# EAGLE schematic Stovetop-v3.0_Release (EAGLE 9.5.2)

## Sheet 1 of 10
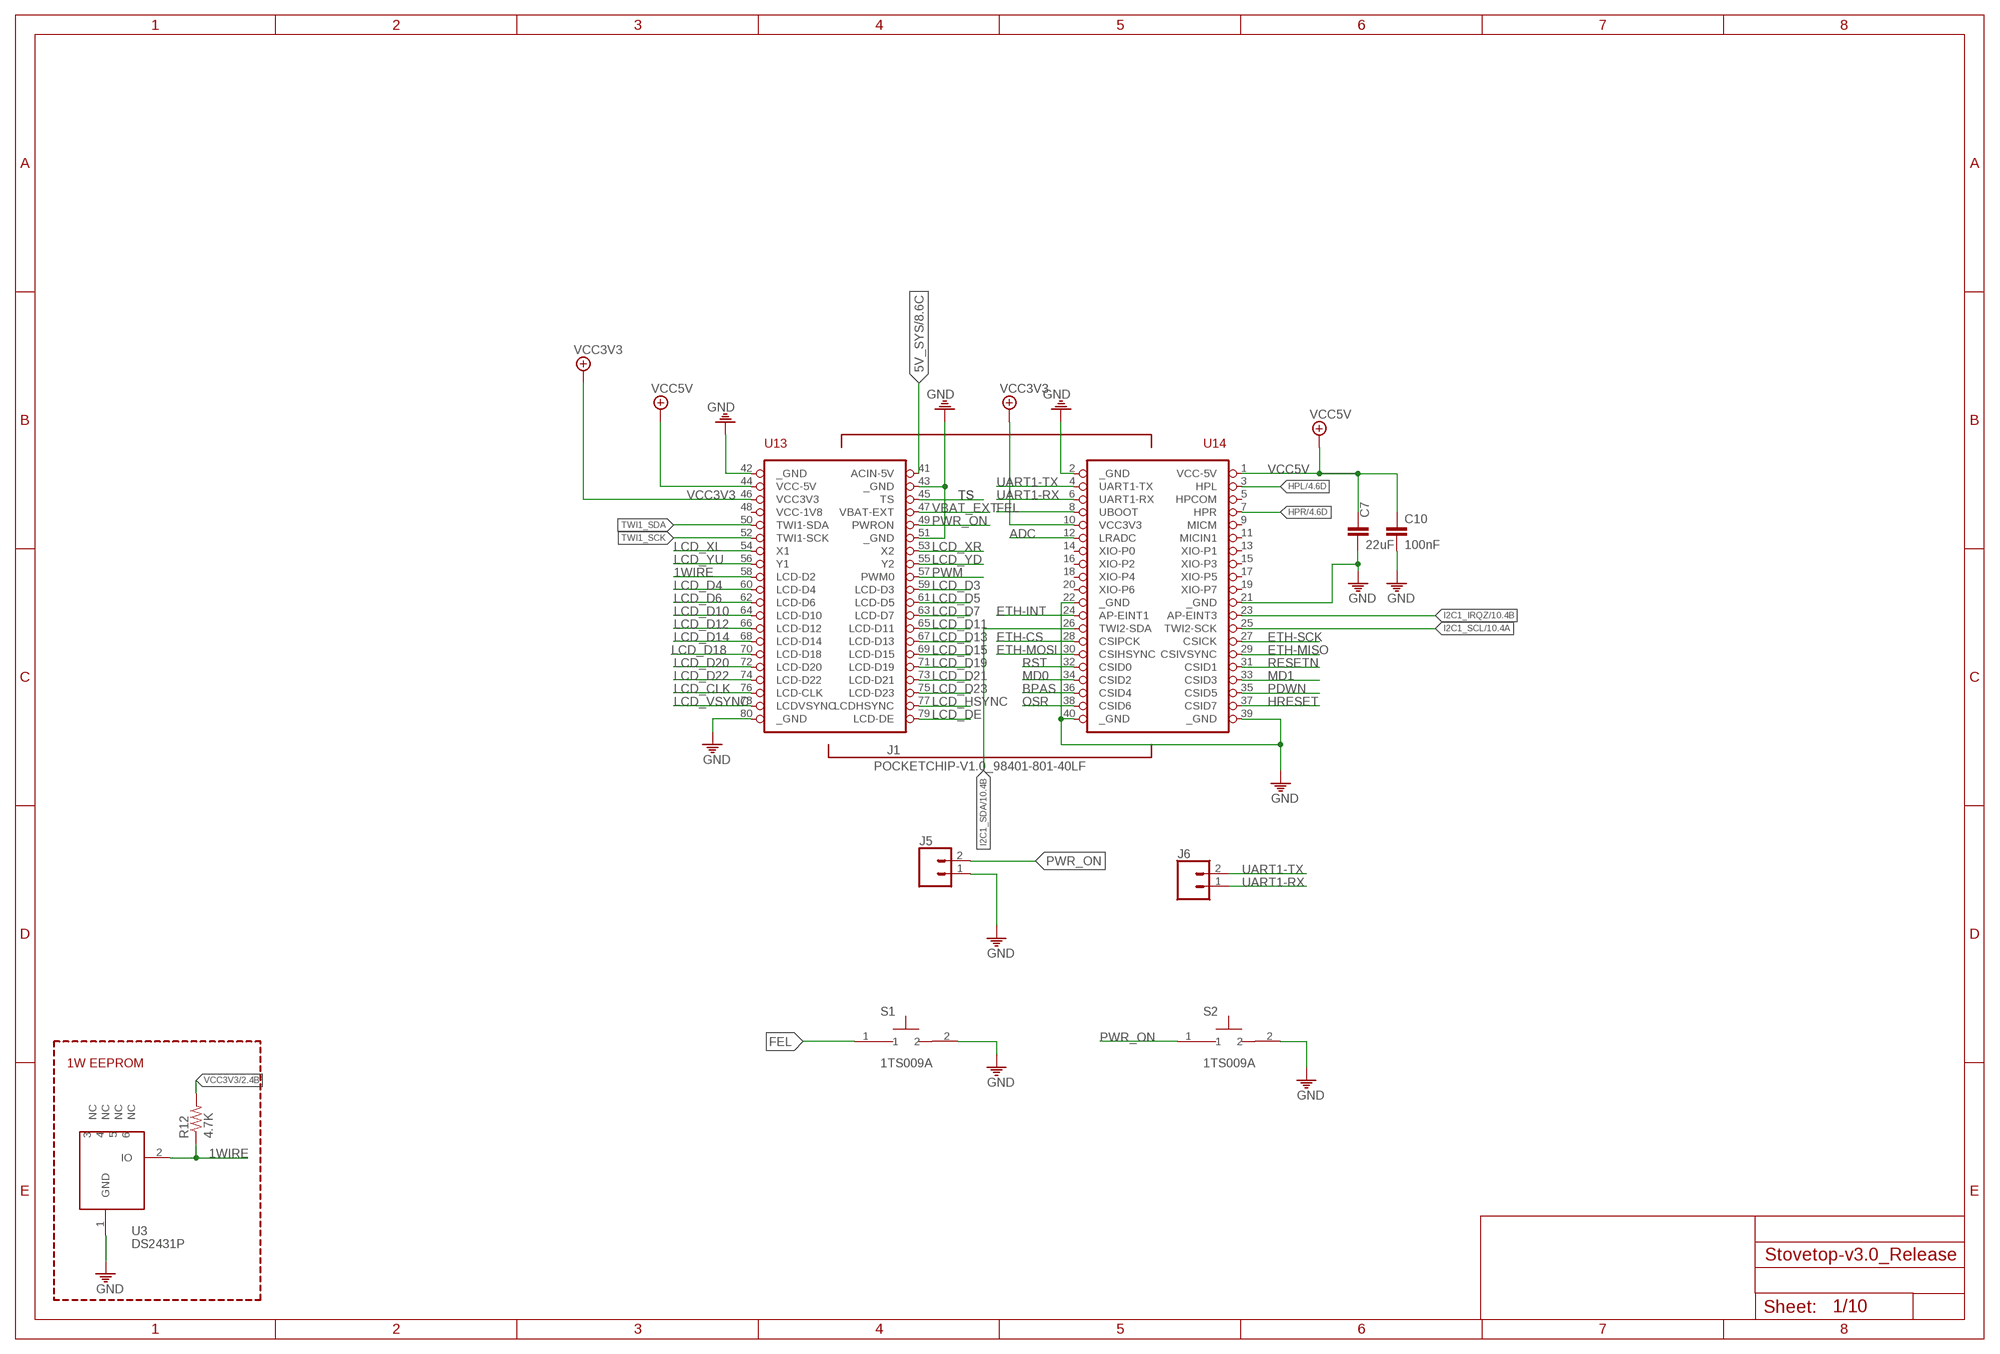
[diagram p0: schematic, sheet 1]

### Parts
C7  22uF  C1206_22UF_50V_10%  [C1206]
C10  100nF  C0402_100NF_50V_10%  [C0402]
J1  POCKETCHIP-V1.0_98401-801-40LF  [POCKETCHIP-V1.0_98401-801-40LF]
J5  CONN_02LOCK  [1X02_LOCK]
J6  CONN_02LOCK  [1X02_LOCK]
R12  4.7K  R0402_4K7_5%  [R0402]
S1  1TS009A  [1TS009A]
S2  1TS009A  [1TS009A]
U3  DS2431P  [TSOC6]

### Nets
1WIRE: J1.58(LCD-D2) R12.1 U3.2(IO)
5V_SYS: J1.41(ACIN-5V) ; also sheet 8,9
ADC: J1.12(LRADC)
BPAS: J1.36(CSID4) ; also sheet 4
ETH-CS: J1.28(CSIPCK) ; also sheet 2
ETH-INT: J1.24(AP-EINT1) ; also sheet 2
ETH-MISO: J1.29(CSIVSYNC) ; also sheet 2
ETH-MOSI: J1.30(CSIHSYNC) ; also sheet 2
ETH-SCK: J1.27(CSICK) ; also sheet 2
FEL: J1.8(UBOOT) S1.1
GND: C7.2 C10.2 J1.2(_GND) J1.21(_GND) J1.22(_GND) J1.39(_GND) J1.40(_GND) J1.42(_GND) J1.43(_GND) J1.51(_GND) J1.80(_GND) J5.1 S1.2 S2.2 U3.1(GND) ; also sheet 2,3,4,5,6,7,8,9,10
HPL: J1.3(HPL) ; also sheet 4
HPR: J1.7(HPR) ; also sheet 4
HRESET: J1.37(CSID7) ; also sheet 10
I2C1_IRQZ: J1.23(AP-EINT3) ; also sheet 10
I2C1_SCL: J1.25(TWI2-SCK) ; also sheet 10
I2C1_SDA: J1.26(TWI2-SDA) ; also sheet 10
LCD_CLK: J1.76(LCD-CLK) ; also sheet 5
LCD_D3: J1.59(LCD-D3) ; also sheet 5
LCD_D4: J1.60(LCD-D4) ; also sheet 5
LCD_D5: J1.61(LCD-D5) ; also sheet 5
LCD_D6: J1.62(LCD-D6) ; also sheet 5
LCD_D7: J1.63(LCD-D7) ; also sheet 5
LCD_D10: J1.64(LCD-D10) ; also sheet 5
LCD_D11: J1.65(LCD-D11) ; also sheet 5
LCD_D12: J1.66(LCD-D12) ; also sheet 5
LCD_D13: J1.67(LCD-D13) ; also sheet 5
LCD_D14: J1.68(LCD-D14) ; also sheet 5
LCD_D15: J1.69(LCD-D15) ; also sheet 5
LCD_D18: J1.70(LCD-D18) ; also sheet 5
LCD_D19: J1.71(LCD-D19) ; also sheet 5
LCD_D20: J1.72(LCD-D20) ; also sheet 5
LCD_D21: J1.73(LCD-D21) ; also sheet 5
LCD_D22: J1.74(LCD-D22) ; also sheet 5
LCD_D23: J1.75(LCD-D23) ; also sheet 5
LCD_DE: J1.79(LCD-DE) ; also sheet 5
LCD_HSYNC: J1.77(LCDHSYNC) ; also sheet 5
LCD_VSYNC: J1.78(LCDVSYNC) ; also sheet 5
LCD_XL: J1.54(X1)
LCD_XR: J1.53(X2)
LCD_YD: J1.55(Y2)
LCD_YU: J1.56(Y1)
MD0: J1.34(CSID2) ; also sheet 4
MD1: J1.33(CSID3) ; also sheet 4
OSR: J1.38(CSID6) ; also sheet 4
PDWN: J1.35(CSID5) ; also sheet 4
PWM: J1.57(PWM0)
PWR_ON: J1.49(PWRON) J5.2 S2.1
RESETN: J1.31(CSID1)
RST: J1.32(CSID0) ; also sheet 5
TS: J1.45(TS)
TWI1_SCK: J1.52(TWI1-SCK) ; also sheet 5,6
TWI1_SDA: J1.50(TWI1-SDA) ; also sheet 5,6
UART1-RX: J1.6(UART1-RX) J6.1 ; also sheet 9
UART1-TX: J1.4(UART1-TX) J6.2 ; also sheet 9
VBAT_EXT: J1.47(VBAT-EXT)
VCC3V3: J1.10(VCC3V3) J1.46(VCC3V3) R12.2 ; also sheet 2,3,4,5,9,10
VCC5V: C7.1 C10.1 J1.1(VCC-5V) J1.44(VCC-5V) ; also sheet 3,4,10
Unconnected: J1.5(HPCOM) J1.9(MICM) J1.11(MICIN1) J1.13(XIO-P1) J1.14(XIO-P0) J1.15(XIO-P3) J1.16(XIO-P2) J1.17(XIO-P5) J1.18(XIO-P4) J1.19(XIO-P7) J1.20(XIO-P6) J1.48(VCC-1V8) U3.3(NC) U3.4(NC) U3.5(NC) U3.6(NC)

### Notes on the sheet
- 1W EEPROM

## Sheet 2 of 10
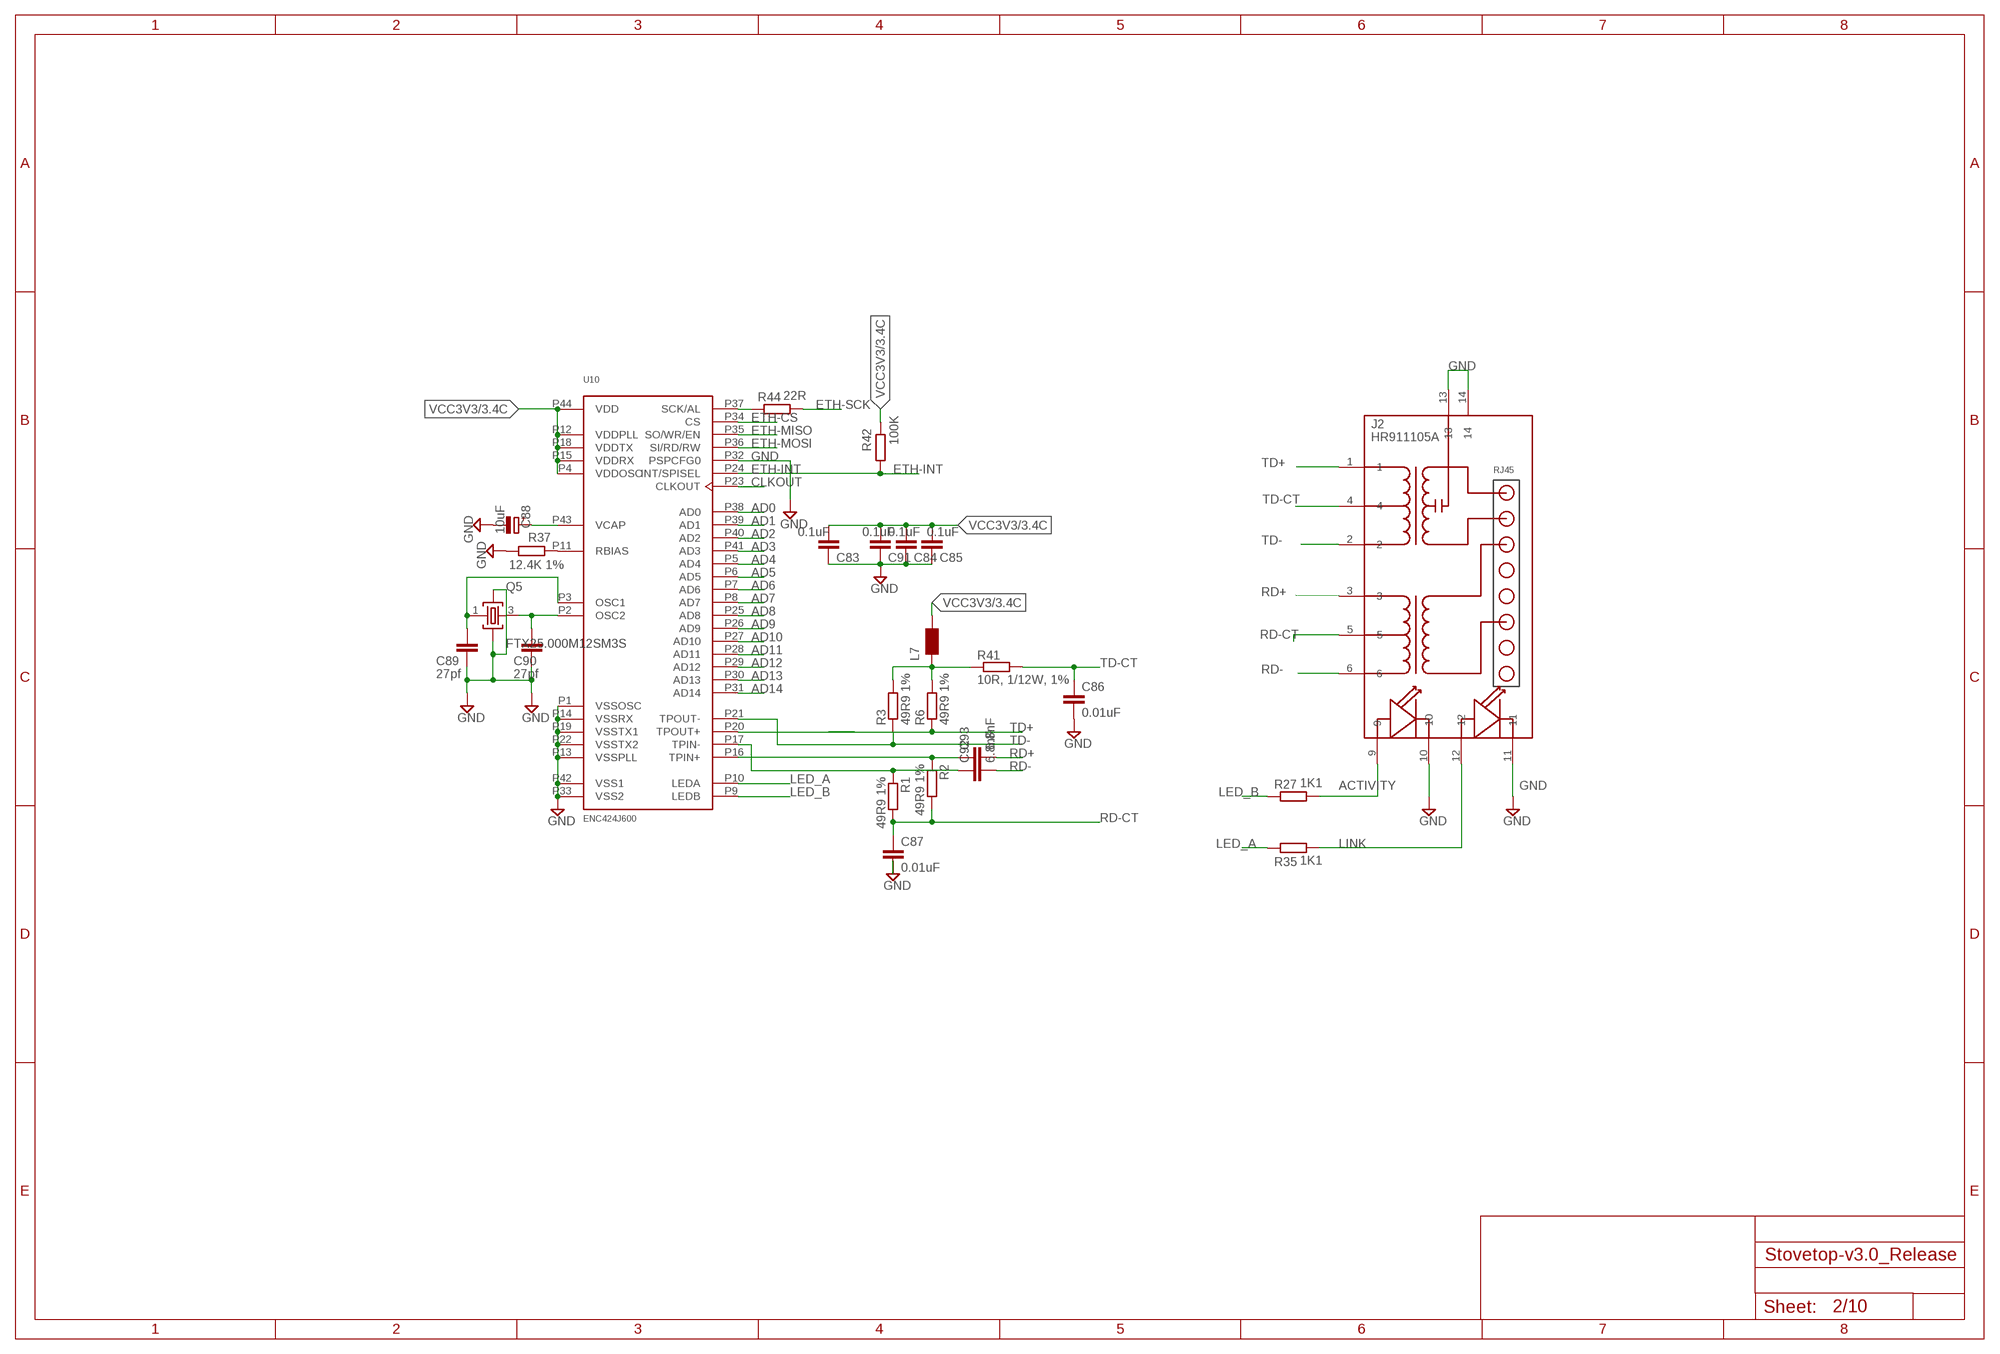
[diagram p1: schematic, sheet 2]

### Parts
C83  0.1uF  C-EUC0603  [C0603]
C84  0.1uF  C-EUC0603  [C0603]
C85  0.1uF  C-EUC0603  [C0603]
C86  0.01uF  C-EUC0603  [C0603]
C87  0.01uF  C-EUC0603  [C0603]
C88  10uF  CPOL-EUSMCA  [SMC_A]
C89  27pf  C-EUC0603  [C0603]
C90  27pf  C-EUC0603  [C0603]
C91  0.1uF  C-EUC0603  [C0603]
C92  6.8nF  C-EUC0603  [C0603]
C93  6.8nF  C-EUC0603  [C0603]
J2  HR911105A  [HR911105A]
L7  WE-KIL_0805  [WE-KI_0805_B]
Q5  FTX25.000M12SM3S  CRISTALLI_0846_FTX25.000M12SM3S  [CRISTALLI_CRYSTAL3.2X2.5]
R1  49R9 1%  R-EU_R0603  [R0603]
R2  49R9 1%  R-EU_R0603  [R0603]
R3  49R9 1%  R-EU_R0603  [R0603]
R6  49R9 1%  R-EU_R0603  [R0603]
R27  1K1  R-EU_R0603  [R0603]
R35  1K1  R-EU_R0603  [R0603]
R37  12.4K 1%  R-EU_R0603  [R0603]
R41  10R, 1/12W, 1%  R-EU_R0603  [R0603]
R42  100K  R-EU_R0603  [R0603]
R44  22R  R-EU_R0603  [R0603]
U10  ENC424J600  [TQFP44]

### Nets
ACTIVITY: J2.9 R27.2
AD0: U10.P38(AD0)
AD1: U10.P39(AD1)
AD2: U10.P40(AD2)
AD3: U10.P41(AD3)
AD4: U10.P5(AD4)
AD5: U10.P6(AD5)
AD6: U10.P7(AD6)
AD7: U10.P8(AD7)
AD8: U10.P25(AD8)
AD9: U10.P26(AD9)
AD10: U10.P27(AD10)
AD11: U10.P28(AD11)
AD12: U10.P29(AD12)
AD13: U10.P30(AD13)
AD14: U10.P31(AD14)
CCT: L7.2 R3.2 R6.2 R41.1
CLKOUT: U10.P23(CLKOUT)
DSFGDF [SPI DIFF]: C92.1 R1.1 U10.P17(TPIN-)
DSGDFSG [SPI DIFF]: C93.1 R2.1 U10.P16(TPIN+)
ETH-CS: U10.P34(CS) ; also sheet 1
ETH-INT: R42.2 U10.P24(INT/SPISEL) ; also sheet 1
ETH-MISO: U10.P35(SO/WR/EN) ; also sheet 1
ETH-MOSI: U10.P36(SI/RD/RW) ; also sheet 1
ETH-SCK: R44.2 ; also sheet 1
GND: C83.2 C84.2 C85.2 C86.2 C87.2 C88.- C89.2 C90.2 C91.2 J2.10 J2.11 J2.13 J2.14 Q5.2 Q5.4 R37.2 U10.P1(VSSOSC) U10.P13(VSSPLL) U10.P14(VSSRX) U10.P19(VSSTX1) U10.P22(VSSTX2) U10.P32(PSPCFG0) U10.P33(VSS2) U10.P42(VSS1) ; also sheet 1,3,4,5,6,7,8,9,10
LED_A: R35.1 U10.P10(LEDA)
LED_B: R27.1 U10.P9(LEDB)
LINK: J2.12 R35.2
N$42: R44.1 U10.P37(SCK/AL)
N$50: C88.+ U10.P43(VCAP)
N$51: R37.1 U10.P11(RBIAS)
N$73: C89.1 Q5.1 U10.P3(OSC1)
N$74: C90.1 Q5.3 U10.P2(OSC2)
RD+ [SPI DIFF]: C93.2 J2.3
RD- [SPI DIFF]: C92.2 J2.6
RD-CT: C87.1 J2.5 R1.2 R2.2
TD+ [SPI DIFF]: J2.1 R6.1 U10.P20(TPOUT+)
TD- [SPI DIFF]: J2.2 R3.1 U10.P21(TPOUT-)
TD-CT: C86.1 J2.4 R41.2
VCC3V3: C83.1 C84.1 C85.1 C91.1 L7.1 R42.1 U10.P4(VDDOSC) U10.P12(VDDPLL) U10.P15(VDDRX) U10.P18(VDDTX) U10.P44(VDD) ; also sheet 1,3,4,5,9,10

## Sheet 3 of 10
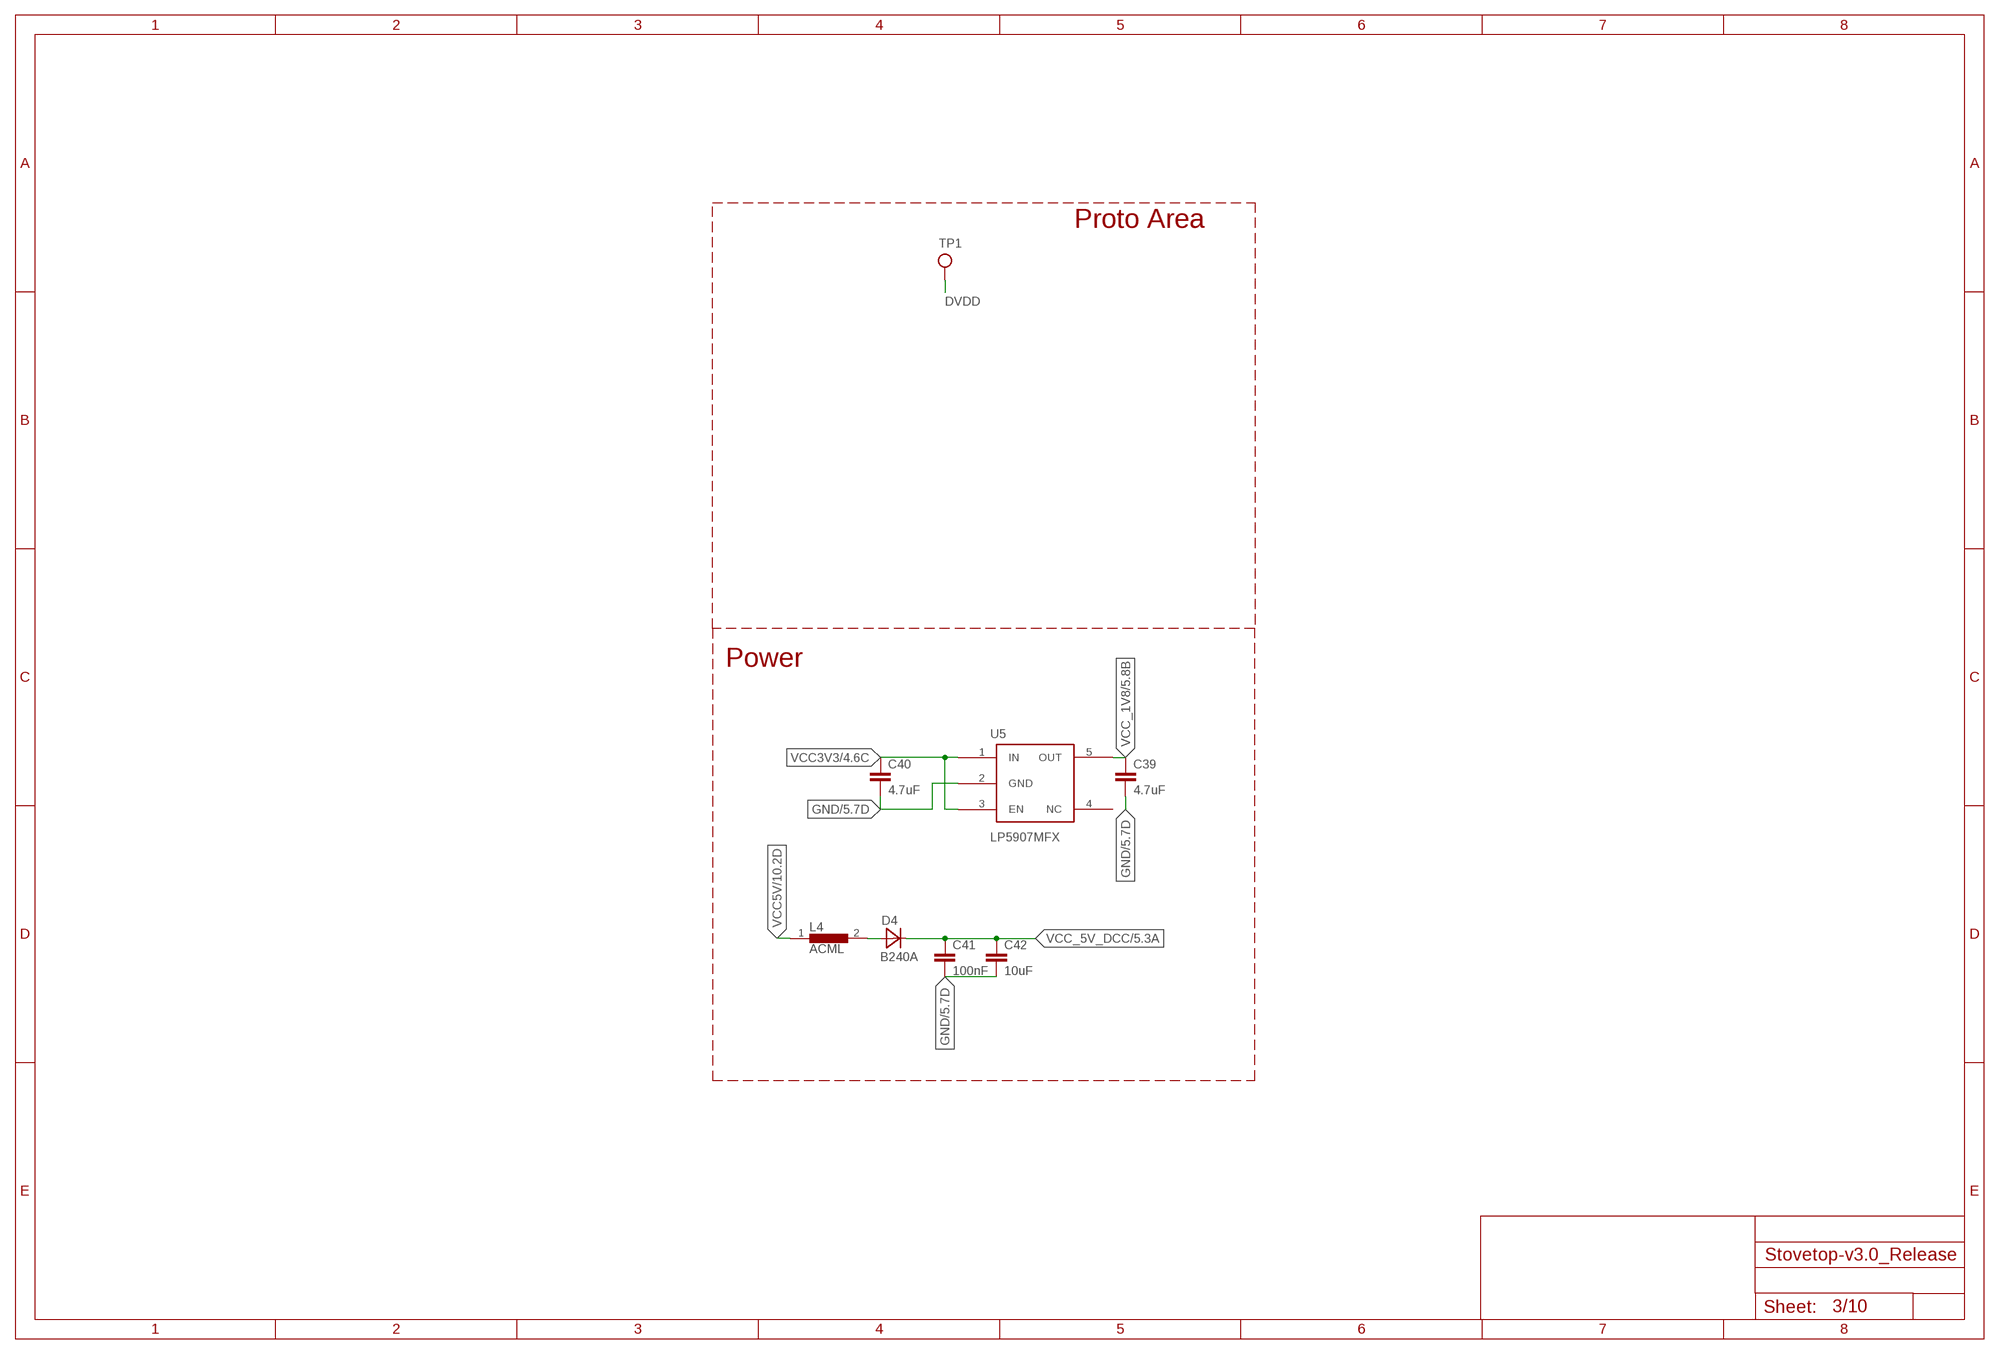
[diagram p2: schematic, sheet 3]

### Parts
C39  4.7uF  CAPACITOR  [1608_0603]
C40  4.7uF  CAPACITOR  [1608_0603]
C41  100nF  CAPACITOR  [1608_0603]
C42  10uF  CAPACITOR  [1608_0603]
D4  B240A  [SMA]
L4  ACML  [0603]
TP1  CHIP_HDMI_TEST_POINT  [CHIP_HDMI_TP-1MMX1MM]
U5  LP5907MFX  [SOT23-5]

### Nets
DVDD: TP1.0 ; also sheet 5
GND: C39.2 C40.2 C41.2 C42.2 U5.2(GND) ; also sheet 1,2,4,5,6,7,8,9,10
N$1: D4.1(A) L4.2
VCC3V3: C40.1 U5.1(IN) U5.3(EN) ; also sheet 1,2,4,5,9,10
VCC5V: L4.1 ; also sheet 1,4,10
VCC_1V8: C39.1 U5.5(OUT) ; also sheet 5
VCC_5V_DCC: C41.1 C42.1 D4.2(C) ; also sheet 5,6
Unconnected: U5.4(NC)

### Notes on the sheet
- Proto Area
- Power

## Sheet 4 of 10
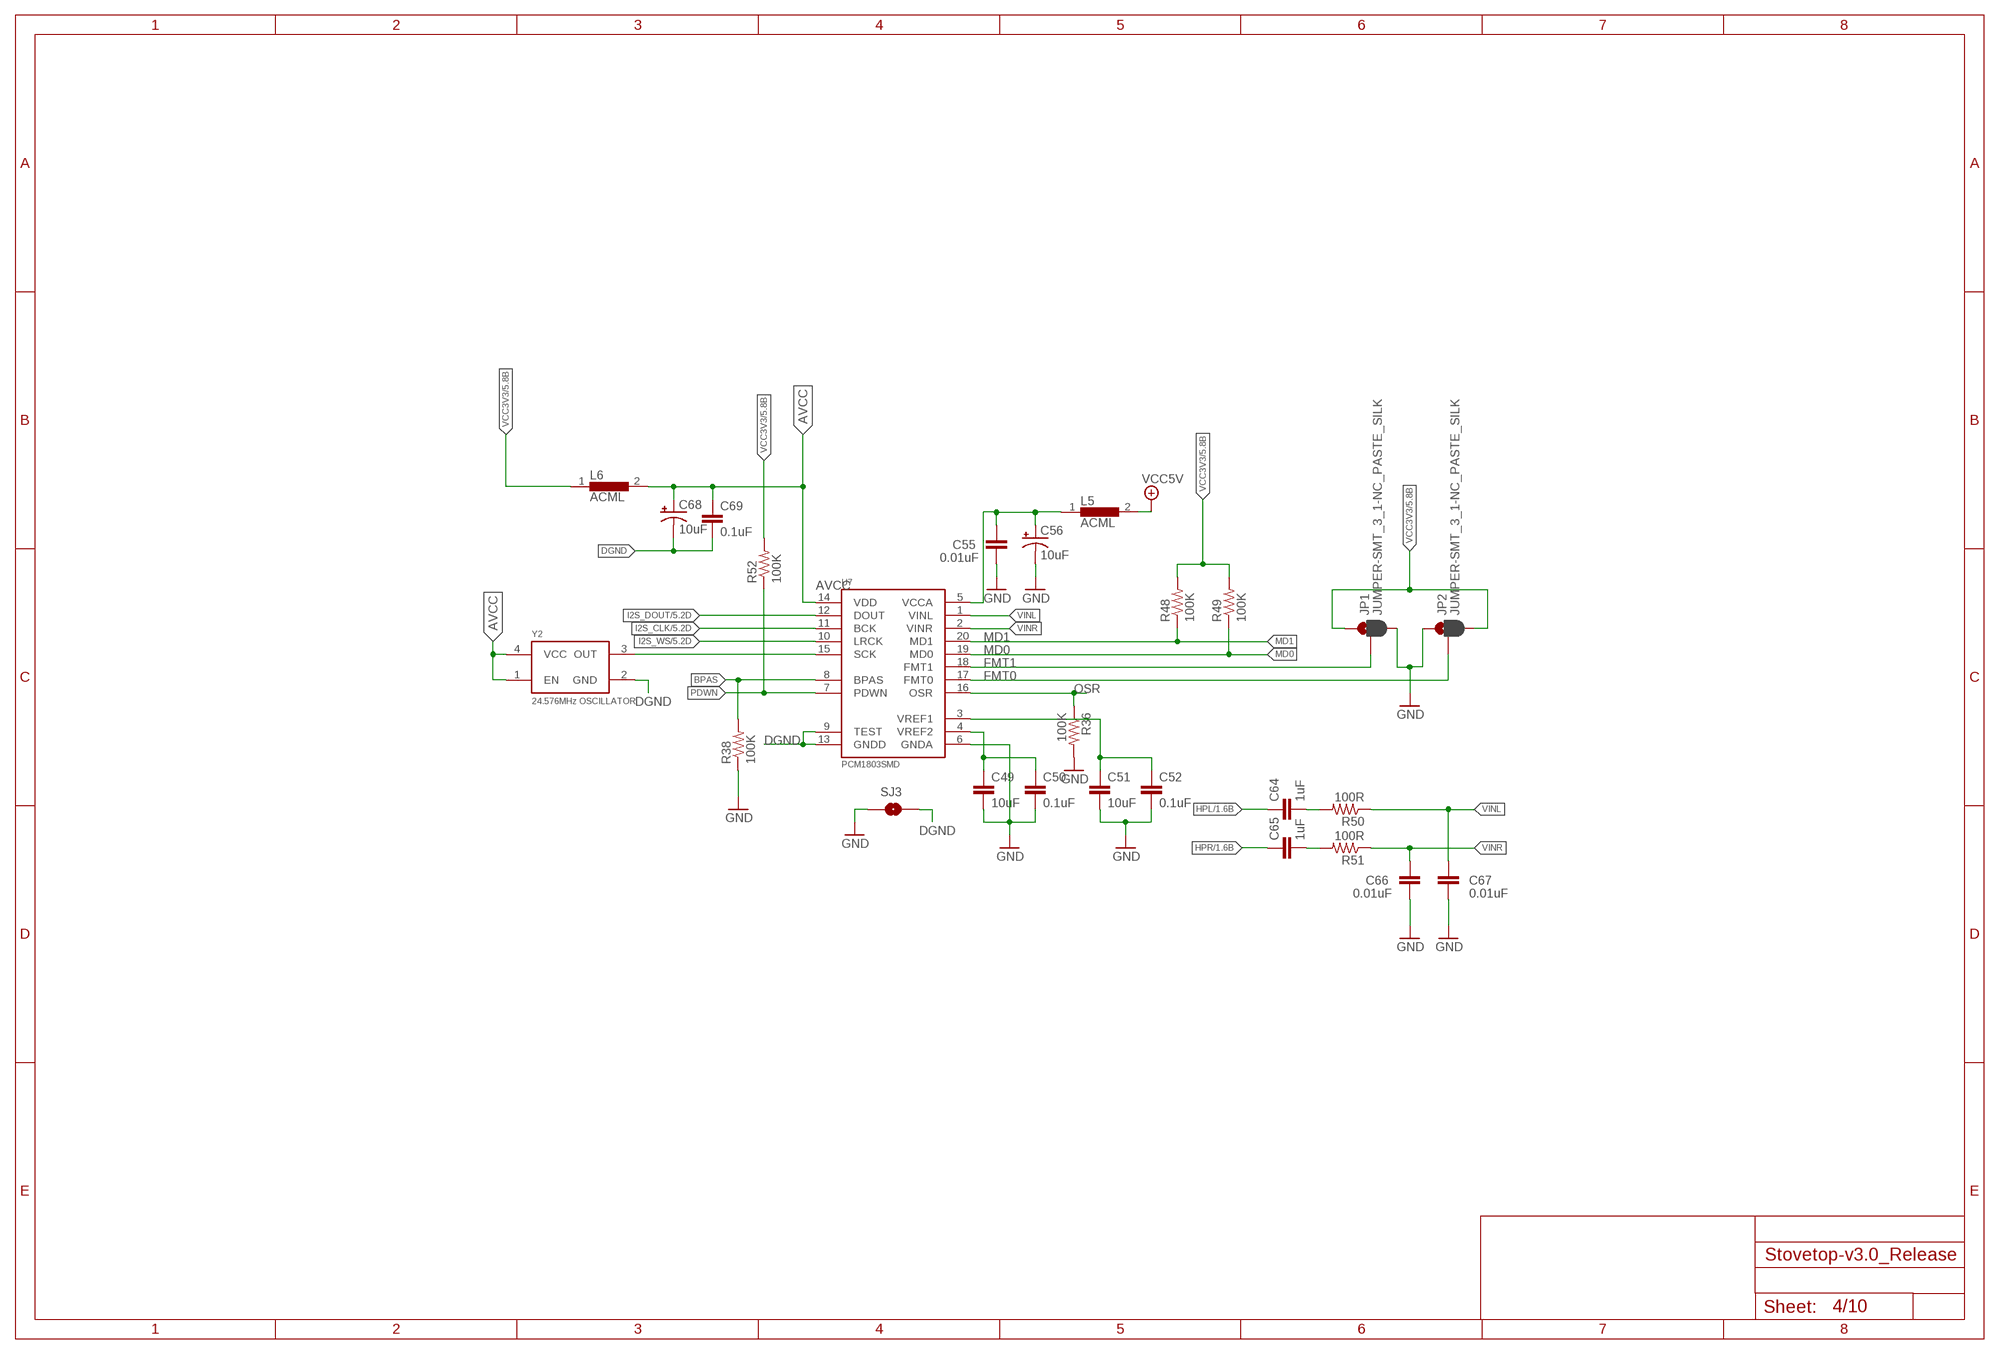
[diagram p3: schematic, sheet 4]

### Parts
C49  10uF  4.7UF-0603-6.3V-(10%)  [0603]
C50  0.1uF  CAP0402-CAP  [0402-CAP]
C51  10uF  4.7UF-0603-6.3V-(10%)  [0603]
C52  0.1uF  CAP0402-CAP  [0402-CAP]
C55  0.01uF  CAP0402-CAP  [0402-CAP]
C56  10uF  CAP_POL1206  [EIA3216]
C64  1uF  CAP0402-CAP  [0402-CAP]
C65  1uF  CAP0402-CAP  [0402-CAP]
C66  0.01uF  CAP0402-CAP  [0402-CAP]
C67  0.01uF  CAP0402-CAP  [0402-CAP]
C68  10uF  CAP_POL1206  [EIA3216]
C69  0.1uF  CAP0402-CAP  [0402-CAP]
JP1  JUMPER-SMT_3_1-NC_PASTE_SILK  [SMT-JUMPER_3_1-NC_PASTE_SILK]
JP2  JUMPER-SMT_3_1-NC_PASTE_SILK  [SMT-JUMPER_3_1-NC_PASTE_SILK]
L5  ACML  [0603]
L6  ACML  [0603]
R36  100K  RESISTOR  [J1-0603]
R38  100K  RESISTOR  [J1-0603]
R48  100K  RESISTOR  [J1-0603]
R49  100K  RESISTOR  [J1-0603]
R50  100R  RESISTOR  [J1-0603]
R51  100R  RESISTOR  [J1-0603]
R52  100K  RESISTOR  [J1-0603]
SJ3  SPARKFUN_SOLDERJUMPERTRACE  [SPARKFUN_SJ_2S-TRACE]
U7  PCM1803SMD  [SSOP20]
Y2  24.576MHz OSCILLATOR  OSCILLATORSMD6  [CRYSTAL-SMD-7.5X5.2-6PIN]

### Nets
AVCC: C68.A(+) C69.1 L6.2 U7.14(VDD) Y2.1(EN) Y2.4(VCC)
BPAS: R38.2 U7.8(BPAS) ; also sheet 1
DGND: C68.C(-) C69.2 SJ3.2 U7.9(TEST) U7.13(GNDD) Y2.2(GND)
FMT0: JP2.2 U7.17(FMT0)
FMT1: JP1.2 U7.18(FMT1)
GND: C49.2 C50.2 C51.2 C52.2 C55.1 C56.C(-) C66.1 C67.1 JP1.3 JP2.1 R36.2 R38.1 SJ3.1 U7.6(GNDA) ; also sheet 1,2,3,5,6,7,8,9,10
HPL: C64.1 ; also sheet 1
HPR: C65.1 ; also sheet 1
I2S_CLK: U7.11(BCK) ; also sheet 5
I2S_DOUT: U7.12(DOUT) ; also sheet 5
I2S_WS: U7.10(LRCK) ; also sheet 5
MD0: R49.1 U7.19(MD0) ; also sheet 1
MD1: R48.1 U7.20(MD1) ; also sheet 1
N$37: C49.1 C50.1 U7.4(VREF2)
N$38: C51.1 C52.1 U7.3(VREF1)
N$39: U7.15(SCK) Y2.3(OUT)
N$56: C55.2 C56.A(+) L5.1 U7.5(VCCA)
N$71: C64.2 R50.2
N$72: C65.2 R51.2
OSR: R36.1 U7.16(OSR) ; also sheet 1
PDWN: R52.1 U7.7(PDWN) ; also sheet 1
VCC3V3: JP1.1 JP2.3 L6.1 R48.2 R49.2 R52.2 ; also sheet 1,2,3,5,9,10
VCC5V: L5.2 ; also sheet 1,3,10
VINL: C67.2 R50.1 U7.1(VINL)
VINR: C66.2 R51.1 U7.2(VINR)

## Sheet 5 of 10
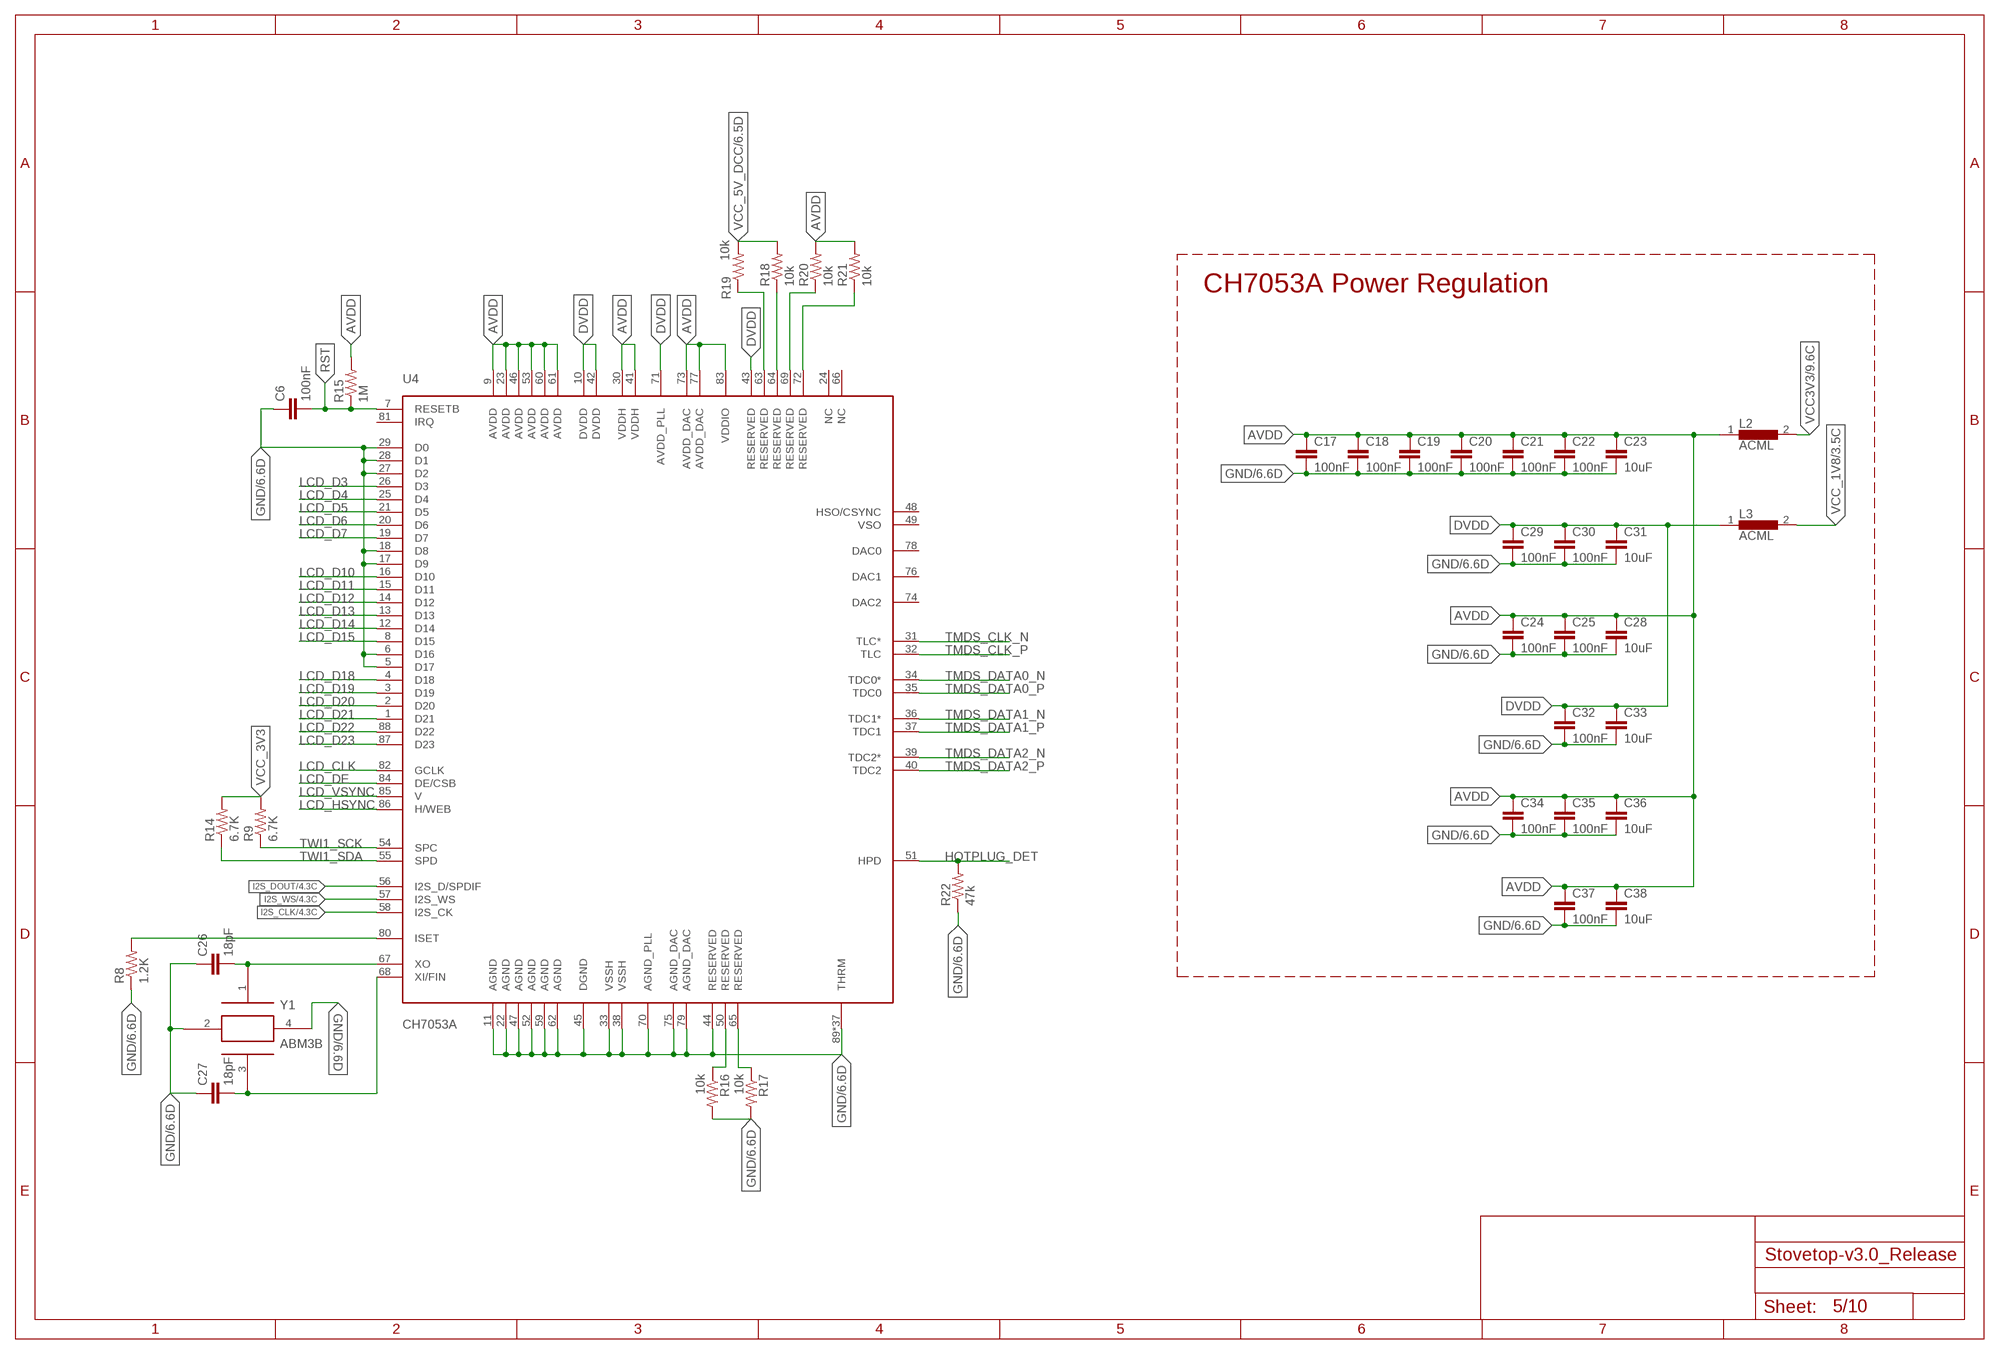
[diagram p4: schematic, sheet 5]

### Parts
C6  100nF  CAPACITOR  [1608_0603]
C17  100nF  CAPACITOR  [1608_0603]
C18  100nF  CAPACITOR  [1608_0603]
C19  100nF  CAPACITOR  [1608_0603]
C20  100nF  CAPACITOR  [1608_0603]
C21  100nF  CAPACITOR  [1608_0603]
C22  100nF  CAPACITOR  [1608_0603]
C23  10uF  CAPACITOR  [1608_0603]
C24  100nF  CAPACITOR  [1608_0603]
C25  100nF  CAPACITOR  [1608_0603]
C26  18pF  CAPACITOR  [1608_0603]
C27  18pF  CAPACITOR  [1608_0603]
C28  10uF  CAPACITOR  [1608_0603]
C29  100nF  CAPACITOR  [1608_0603]
C30  100nF  CAPACITOR  [1608_0603]
C31  10uF  CAPACITOR  [1608_0603]
C32  100nF  CAPACITOR  [1608_0603]
C33  10uF  CAPACITOR  [1608_0603]
C34  100nF  CAPACITOR  [1608_0603]
C35  100nF  CAPACITOR  [1608_0603]
C36  10uF  CAPACITOR  [1608_0603]
C37  100nF  CAPACITOR  [1608_0603]
C38  10uF  CAPACITOR  [1608_0603]
L2  ACML  [0603]
L3  ACML  [0603]
R8  1.2K  RESISTOR  [J1-0603]
R9  6.7K  RESISTOR  [J1-0603]
R14  6.7K  RESISTOR  [J1-0603]
R15  1M  RESISTOR  [J1-0603]
R16  10k  RESISTOR  [J1-0603]
R17  10k  RESISTOR  [J1-0603]
R18  10k  RESISTOR  [J1-0603]
R19  10k  RESISTOR  [J1-0603]
R20  10k  RESISTOR  [J1-0603]
R21  10k  RESISTOR  [J1-0603]
R22  47k  RESISTOR  [J1-0603]
U4  CH7053A  [QFN40P1000X1000X90_HS-89M]
Y1  ABM3B  [ABM3B]

### Nets
AVDD: C17.1 C18.1 C19.1 C20.1 C21.1 C22.1 C23.1 C24.1 C25.1 C28.1 C34.1 C35.1 C36.1 C37.1 C38.1 L2.1 R15.2 R20.2 R21.2 U4.9(AVDD) U4.23(AVDD) U4.30(VDDH) U4.41(VDDH) U4.46(AVDD) U4.53(AVDD) U4.60(AVDD) U4.61(AVDD) U4.73(AVDD_DAC) U4.77(AVDD_DAC) U4.83(VDDIO)
DVDD: C29.1 C30.1 C31.1 C32.1 C33.1 L3.1 U4.10(DVDD) U4.42(DVDD) U4.43(RESERVED) U4.71(AVDD_PLL) ; also sheet 3
GND: C6.1 C17.2 C18.2 C19.2 C20.2 C21.2 C22.2 C23.2 C24.2 C25.2 C26.1 C27.1 C28.2 C29.2 C30.2 C31.2 C32.2 C33.2 C34.2 C35.2 C36.2 C37.2 C38.2 R8.1 R16.2 R17.2 R22.1 U4.5(D17) U4.6(D16) U4.11(AGND) U4.17(D9) U4.18(D8) U4.22(AGND) U4.27(D2) U4.28(D1) U4.29(D0) U4.33(VSSH) U4.38(VSSH) U4.44(RESERVED) U4.45(DGND) U4.47(AGND) U4.52(AGND) U4.59(AGND) U4.62(AGND) U4.70(AGND_PLL) U4.75(AGND_DAC) U4.79(AGND_DAC) U4.89(THRM) U4.P$1(THRM) U4.P$2(THRM) U4.P$3(THRM) U4.P$4(THRM) U4.P$5(THRM) U4.P$6(THRM) U4.P$7(THRM) U4.P$8(THRM) U4.P$9(THRM) U4.P$10(THRM) U4.P$11(THRM) U4.P$12(THRM) U4.P$13(THRM) U4.P$14(THRM) U4.P$15(THRM) U4.P$16(THRM) U4.P$17(THRM) U4.P$18(THRM) U4.P$19(THRM) U4.P$20(THRM) U4.P$21(THRM) U4.P$22(THRM) U4.P$23(THRM) U4.P$24(THRM) U4.P$25(THRM) U4.P$26(THRM) U4.P$27(THRM) U4.P$28(THRM) U4.P$29(THRM) U4.P$30(THRM) U4.P$31(THRM) U4.P$32(THRM) U4.P$33(THRM) U4.P$34(THRM) U4.P$35(THRM) U4.P$36(THRM) Y1.2 Y1.4 ; also sheet 1,2,3,4,6,7,8,9,10
HOTPLUG_DET: R22.2 U4.51(HPD) ; also sheet 6
I2S_CLK: U4.58(I2S_CK) ; also sheet 4
I2S_DOUT: U4.56(I2S_D/SPDIF) ; also sheet 4
I2S_WS: U4.57(I2S_WS) ; also sheet 4
LCD_CLK: U4.82(GCLK) ; also sheet 1
LCD_D3: U4.26(D3) ; also sheet 1
LCD_D4: U4.25(D4) ; also sheet 1
LCD_D5: U4.21(D5) ; also sheet 1
LCD_D6: U4.20(D6) ; also sheet 1
LCD_D7: U4.19(D7) ; also sheet 1
LCD_D10: U4.16(D10) ; also sheet 1
LCD_D11: U4.15(D11) ; also sheet 1
LCD_D12: U4.14(D12) ; also sheet 1
LCD_D13: U4.13(D13) ; also sheet 1
LCD_D14: U4.12(D14) ; also sheet 1
LCD_D15: U4.8(D15) ; also sheet 1
LCD_D18: U4.4(D18) ; also sheet 1
LCD_D19: U4.3(D19) ; also sheet 1
LCD_D20: U4.2(D20) ; also sheet 1
LCD_D21: U4.1(D21) ; also sheet 1
LCD_D22: U4.88(D22) ; also sheet 1
LCD_D23: U4.87(D23) ; also sheet 1
LCD_DE: U4.84(DE/CSB) ; also sheet 1
LCD_HSYNC: U4.86(H/WEB) ; also sheet 1
LCD_VSYNC: U4.85(V) ; also sheet 1
N$9: C27.2 U4.68(XI/FIN) Y1.3
N$24: R8.2 U4.80(ISET)
N$25: R16.1 U4.50(RESERVED)
N$26: R17.1 U4.65(RESERVED)
N$27: R19.1 U4.63(RESERVED)
N$28: R18.1 U4.64(RESERVED)
N$30: R21.1 U4.72(RESERVED)
N$31: R20.1 U4.69(RESERVED)
N$32: C26.2 U4.67(XO) Y1.1
RST: C6.2 R15.1 U4.7(RESETB) ; also sheet 1
TMDS_CLK_N: U4.31(TLC*) ; also sheet 6
TMDS_CLK_P: U4.32(TLC) ; also sheet 6
TMDS_DATA0_N: U4.34(TDC0*) ; also sheet 6
TMDS_DATA0_P: U4.35(TDC0) ; also sheet 6
TMDS_DATA1_N: U4.36(TDC1*) ; also sheet 6
TMDS_DATA1_P: U4.37(TDC1) ; also sheet 6
TMDS_DATA2_N: U4.39(TDC2*) ; also sheet 6
TMDS_DATA2_P: U4.40(TDC2) ; also sheet 6
TWI1_SCK: R9.1 U4.54(SPC) ; also sheet 1,6
TWI1_SDA: R14.1 U4.55(SPD) ; also sheet 1,6
VCC3V3: L2.2 ; also sheet 1,2,3,4,9,10
VCC_1V8: L3.2 ; also sheet 3
VCC_3V3: R9.2 R14.2
VCC_5V_DCC: R18.2 R19.2 ; also sheet 3,6
Unconnected: U4.24(NC) U4.48(HSO/CSYNC) U4.49(VSO) U4.66(NC) U4.74(DAC2) U4.76(DAC1) U4.78(DAC0) U4.81(IRQ)

### Notes on the sheet
- CH7053A Power Regulation

## Sheet 6 of 10
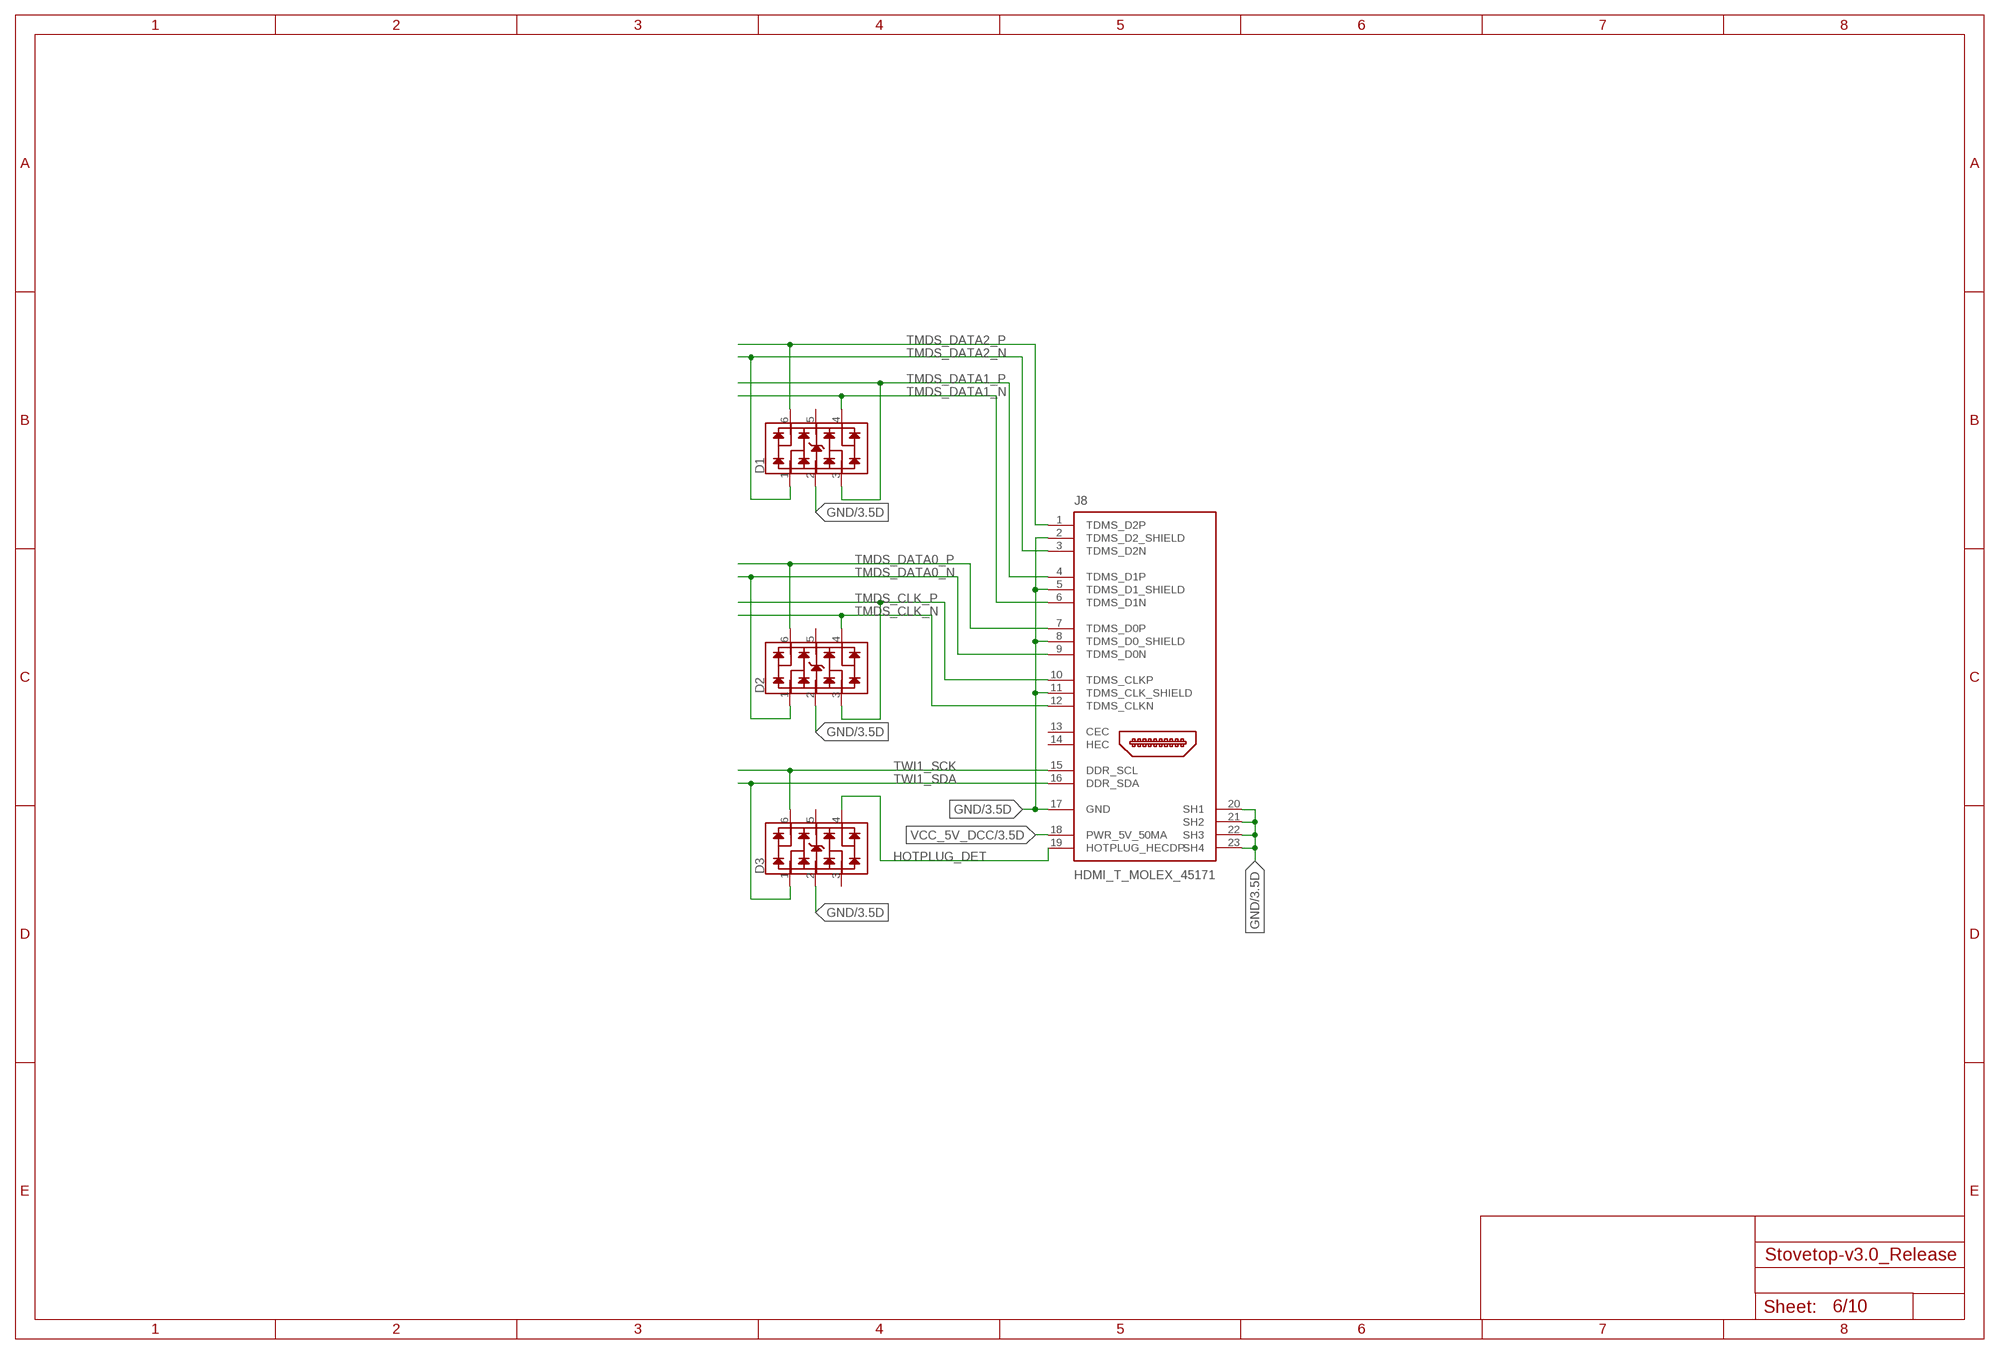
[diagram p5: schematic, sheet 6]

### Parts
D1  D-SEMTECH-RCLAMP0504S  [T_SOT95P285X90-6N]
D2  D-SEMTECH-RCLAMP0504S  [T_SOT95P285X90-6N]
D3  D-SEMTECH-RCLAMP0504S  [T_SOT95P285X90-6N]
J8  HDMI_T_MOLEX_45171  CHIP_HDMI_T_MOLEX_45171  [CHIP_HDMI_T_MOLEX_45171]

### Nets
GND: D1.2 D2.2 D3.2 J8.2(TDMS_D2_SHIELD) J8.5(TDMS_D1_SHIELD) J8.8(TDMS_D0_SHIELD) J8.11(TDMS_CLK_SHIELD) J8.17(GND) J8.20(SH1) J8.21(SH2) J8.22(SH3) J8.23(SH4) ; also sheet 1,2,3,4,5,7,8,9,10
HOTPLUG_DET: D3.4 J8.19(HOTPLUG_HECDP) ; also sheet 5
TMDS_CLK_N: D2.4 J8.12(TDMS_CLKN) ; also sheet 5
TMDS_CLK_P: D2.3 J8.10(TDMS_CLKP) ; also sheet 5
TMDS_DATA0_N: D2.1 J8.9(TDMS_D0N) ; also sheet 5
TMDS_DATA0_P: D2.6 J8.7(TDMS_D0P) ; also sheet 5
TMDS_DATA1_N: D1.4 J8.6(TDMS_D1N) ; also sheet 5
TMDS_DATA1_P: D1.3 J8.4(TDMS_D1P) ; also sheet 5
TMDS_DATA2_N: D1.1 J8.3(TDMS_D2N) ; also sheet 5
TMDS_DATA2_P: D1.6 J8.1(TDMS_D2P) ; also sheet 5
TWI1_SCK: D3.6 J8.15(DDR_SCL) ; also sheet 1,5
TWI1_SDA: D3.1 J8.16(DDR_SDA) ; also sheet 1,5
VCC_5V_DCC: J8.18(PWR_5V_50MA) ; also sheet 3,5
Unconnected: D1.5 D2.5 D3.3 D3.5 J8.13(CEC) J8.14(HEC)

## Sheet 7 of 10
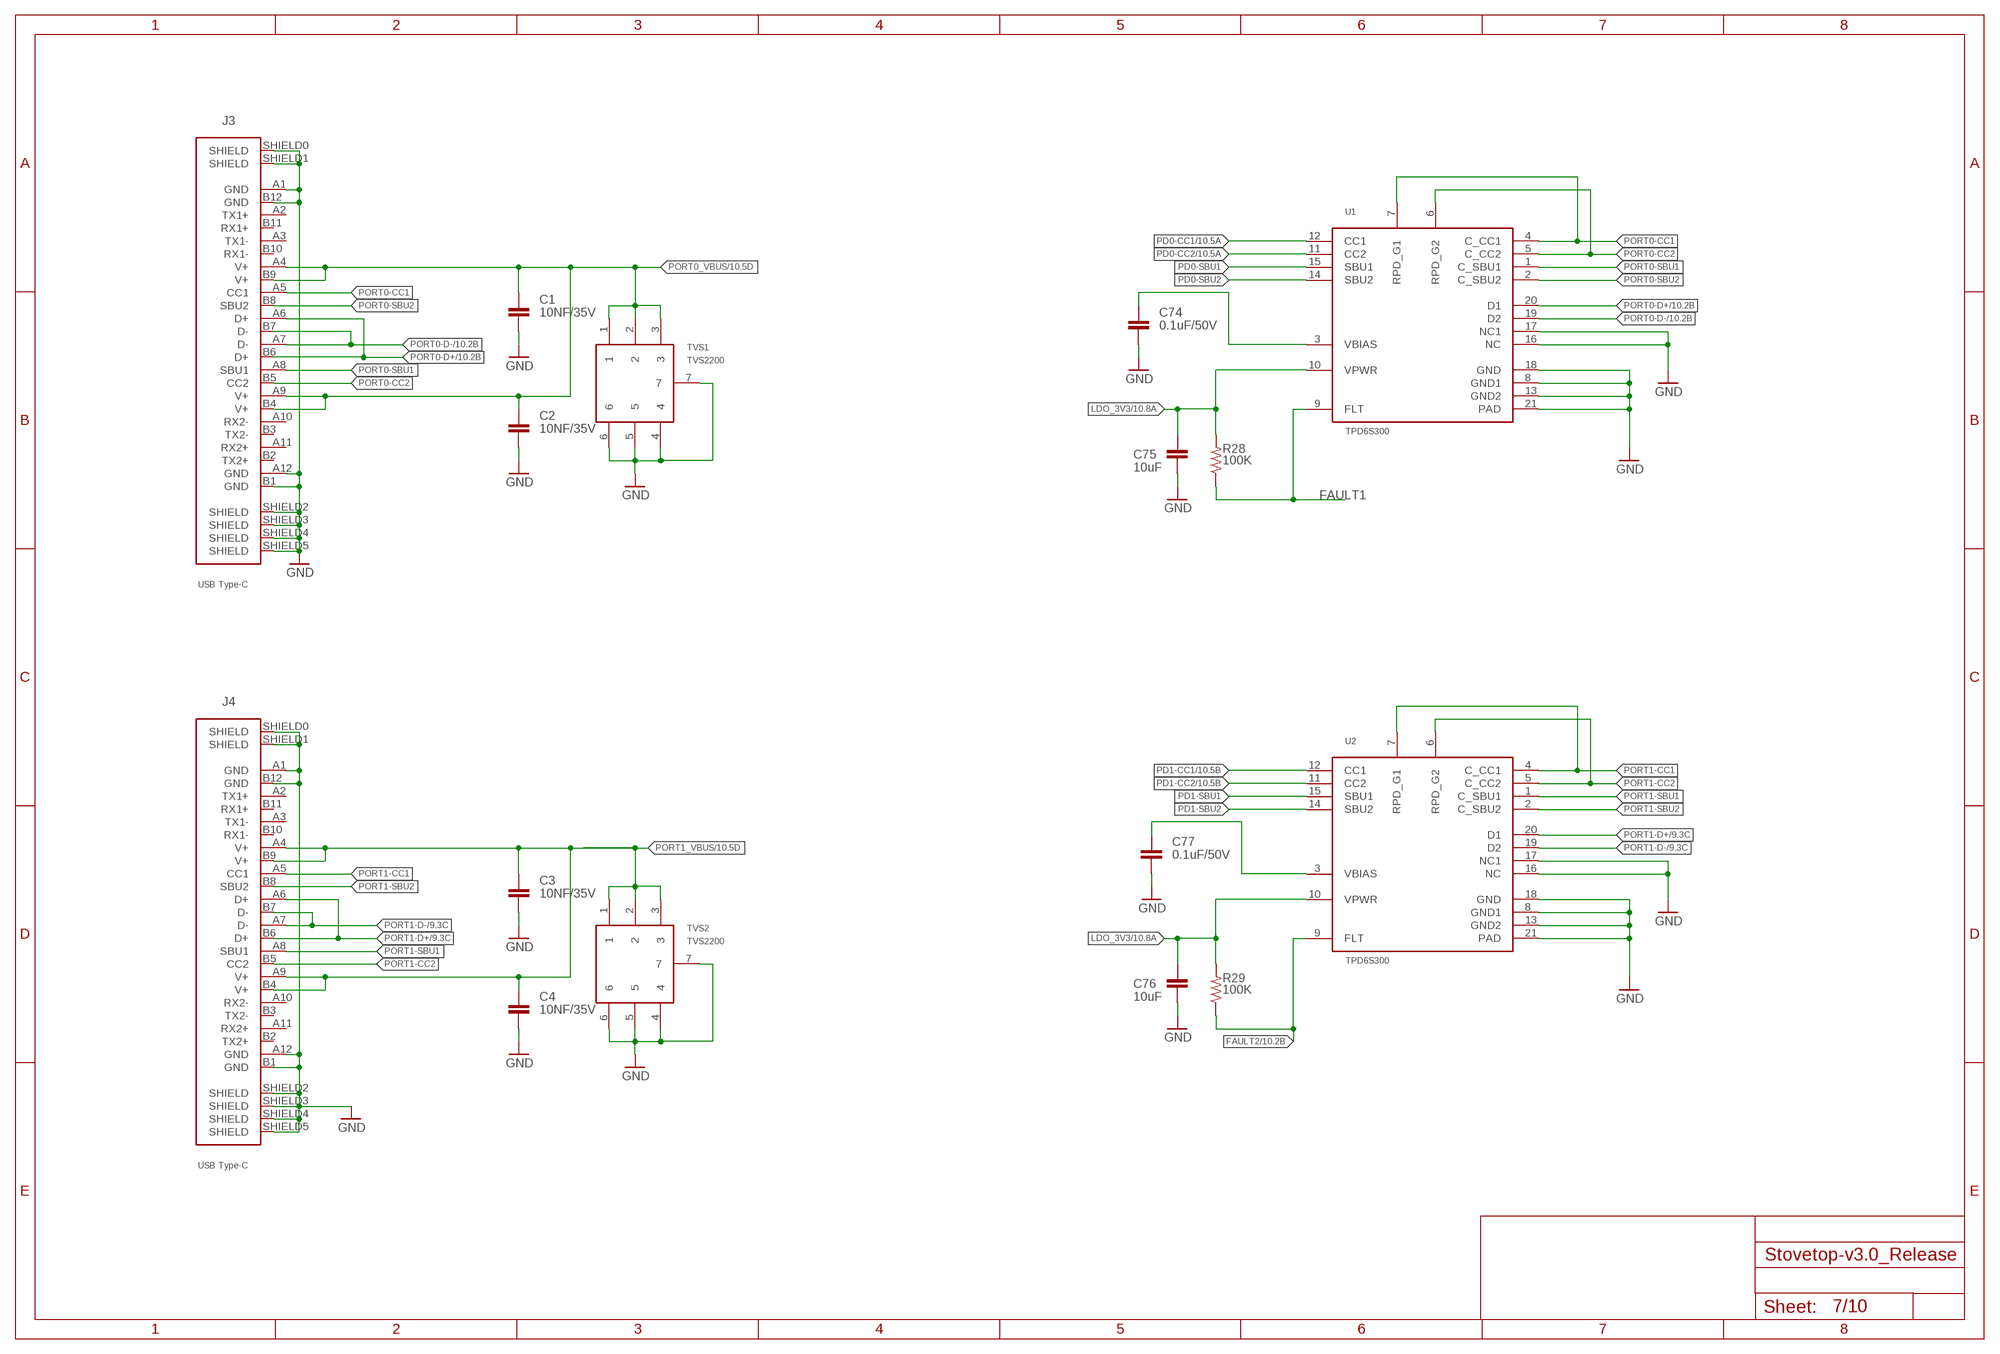
[diagram p6: schematic, sheet 7]

### Parts
C1  10NF/35V  CAP0402-CAP  [0402-CAP]
C2  10NF/35V  CAP0402-CAP  [0402-CAP]
C3  10NF/35V  CAP0402-CAP  [0402-CAP]
C4  10NF/35V  CAP0402-CAP  [0402-CAP]
C74  0.1uF/50V  CAP0603-CAP  [0603-CAP]
C75  10uF  CAP0603-CAP  [0603-CAP]
C76  10uF  CAP0603-CAP  [0603-CAP]
C77  0.1uF/50V  CAP0603-CAP  [0603-CAP]
J3  STOVETOP-V2.0_03062020_1600_STOVETOP-V2.0_CHECK_TRISTAN-ROBITAILLE'S-LIBRARY_DX07S024JJ2_USB_TYPE-C  [STOVETOP-V2.0_03062020_1600_STOVETOP-V2.0_CHECK_TRISTAN-ROBITAILLE'S-LIBRARY_DX07S0224JJ2_USB-C]
J4  STOVETOP-V2.0_03062020_1600_STOVETOP-V2.0_CHECK_TRISTAN-ROBITAILLE'S-LIBRARY_DX07S024JJ2_USB_TYPE-C  [STOVETOP-V2.0_03062020_1600_STOVETOP-V2.0_CHECK_TRISTAN-ROBITAILLE'S-LIBRARY_DX07S0224JJ2_USB-C]
R28  100K  R-US_R0402  [R0402]
R29  100K  R-US_R0402  [R0402]
TVS1  TVS2200  [TVS2200]
TVS2  TVS2200  [TVS2200]
U1  TPD6S300  [TPD6S300]
U2  TPD6S300  [TPD6S300]

### Nets
FAULT1: R28.1 U1.9(FLT) ; also sheet 10
FAULT2: R29.1 U2.9(FLT) ; also sheet 10
GND: C1.1 C2.1 C3.1 C4.1 C74.1 C75.1 C76.1 C77.1 J3.A1(GND) J3.A12(GND) J3.B1(GND) J3.B12(GND) J3.SHIELD0(SHIELD) J3.SHIELD1(SHIELD) J3.SHIELD2(SHIELD) J3.SHIELD3(SHIELD) J3.SHIELD4(SHIELD) J3.SHIELD5(SHIELD) J4.A1(GND) J4.A12(GND) J4.B1(GND) J4.B12(GND) J4.SHIELD0(SHIELD) J4.SHIELD1(SHIELD) J4.SHIELD2(SHIELD) J4.SHIELD3(SHIELD) J4.SHIELD4(SHIELD) J4.SHIELD5(SHIELD) TVS1.4 TVS1.5 TVS1.6 TVS1.7 TVS2.4 TVS2.5 TVS2.6 TVS2.7 U1.8(GND1) U1.13(GND2) U1.16(NC) U1.17(NC1) U1.18(GND) U1.21(PAD) U2.8(GND1) U2.13(GND2) U2.16(NC) U2.17(NC1) U2.18(GND) U2.21(PAD) ; also sheet 1,2,3,4,5,6,8,9,10
LDO_3V3: C75.2 C76.2 R28.2 R29.2 U1.10(VPWR) U2.10(VPWR) ; also sheet 10
N$44: C74.2 U1.3(VBIAS)
N$49: C77.2 U2.3(VBIAS)
PD0-CC1: U1.12(CC1) ; also sheet 10
PD0-CC2: U1.11(CC2) ; also sheet 10
PD0-SBU1: U1.15(SBU1)
PD0-SBU2: U1.14(SBU2)
PD1-CC1: U2.12(CC1) ; also sheet 10
PD1-CC2: U2.11(CC2) ; also sheet 10
PD1-SBU1: U2.15(SBU1)
PD1-SBU2: U2.14(SBU2)
PORT0-CC1: J3.A5(CC1) U1.4(C_CC1) U1.7(RPD_G1)
PORT0-CC2: J3.B5(CC2) U1.5(C_CC2) U1.6(RPD_G2)
PORT0-D+ [diff]: J3.A6(D+) J3.B6(D+) U1.20(D1) ; also sheet 10
PORT0-D- [diff]: J3.A7(D-) J3.B7(D-) U1.19(D2) ; also sheet 10
PORT0-SBU1: J3.A8(SBU1) U1.1(C_SBU1)
PORT0-SBU2: J3.B8(SBU2) U1.2(C_SBU2)
PORT0_VBUS: C1.2 C2.2 J3.A4(V+) J3.A9(V+) J3.B4(V+) J3.B9(V+) TVS1.1 TVS1.2 TVS1.3 ; also sheet 10
PORT1-CC1: J4.A5(CC1) U2.4(C_CC1) U2.7(RPD_G1)
PORT1-CC2: J4.B5(CC2) U2.5(C_CC2) U2.6(RPD_G2)
PORT1-D+ [diff]: J4.A6(D+) J4.B6(D+) U2.20(D1) ; also sheet 9,10
PORT1-D- [diff]: J4.A7(D-) J4.B7(D-) U2.19(D2) ; also sheet 9,10
PORT1-SBU1: J4.A8(SBU1) U2.1(C_SBU1)
PORT1-SBU2: J4.B8(SBU2) U2.2(C_SBU2)
PORT1_VBUS: C3.2 C4.2 J4.A4(V+) J4.A9(V+) J4.B4(V+) J4.B9(V+) TVS2.1 TVS2.2 TVS2.3 ; also sheet 10
Unconnected: J3.A2(TX1+) J3.A3(TX1-) J3.A10(RX2-) J3.A11(RX2+) J3.B2(TX2+) J3.B3(TX2-) J3.B10(RX1-) J3.B11(RX1+) J4.A2(TX1+) J4.A3(TX1-) J4.A10(RX2-) J4.A11(RX2+) J4.B2(TX2+) J4.B3(TX2-) J4.B10(RX1-) J4.B11(RX1+)

## Sheet 8 of 10
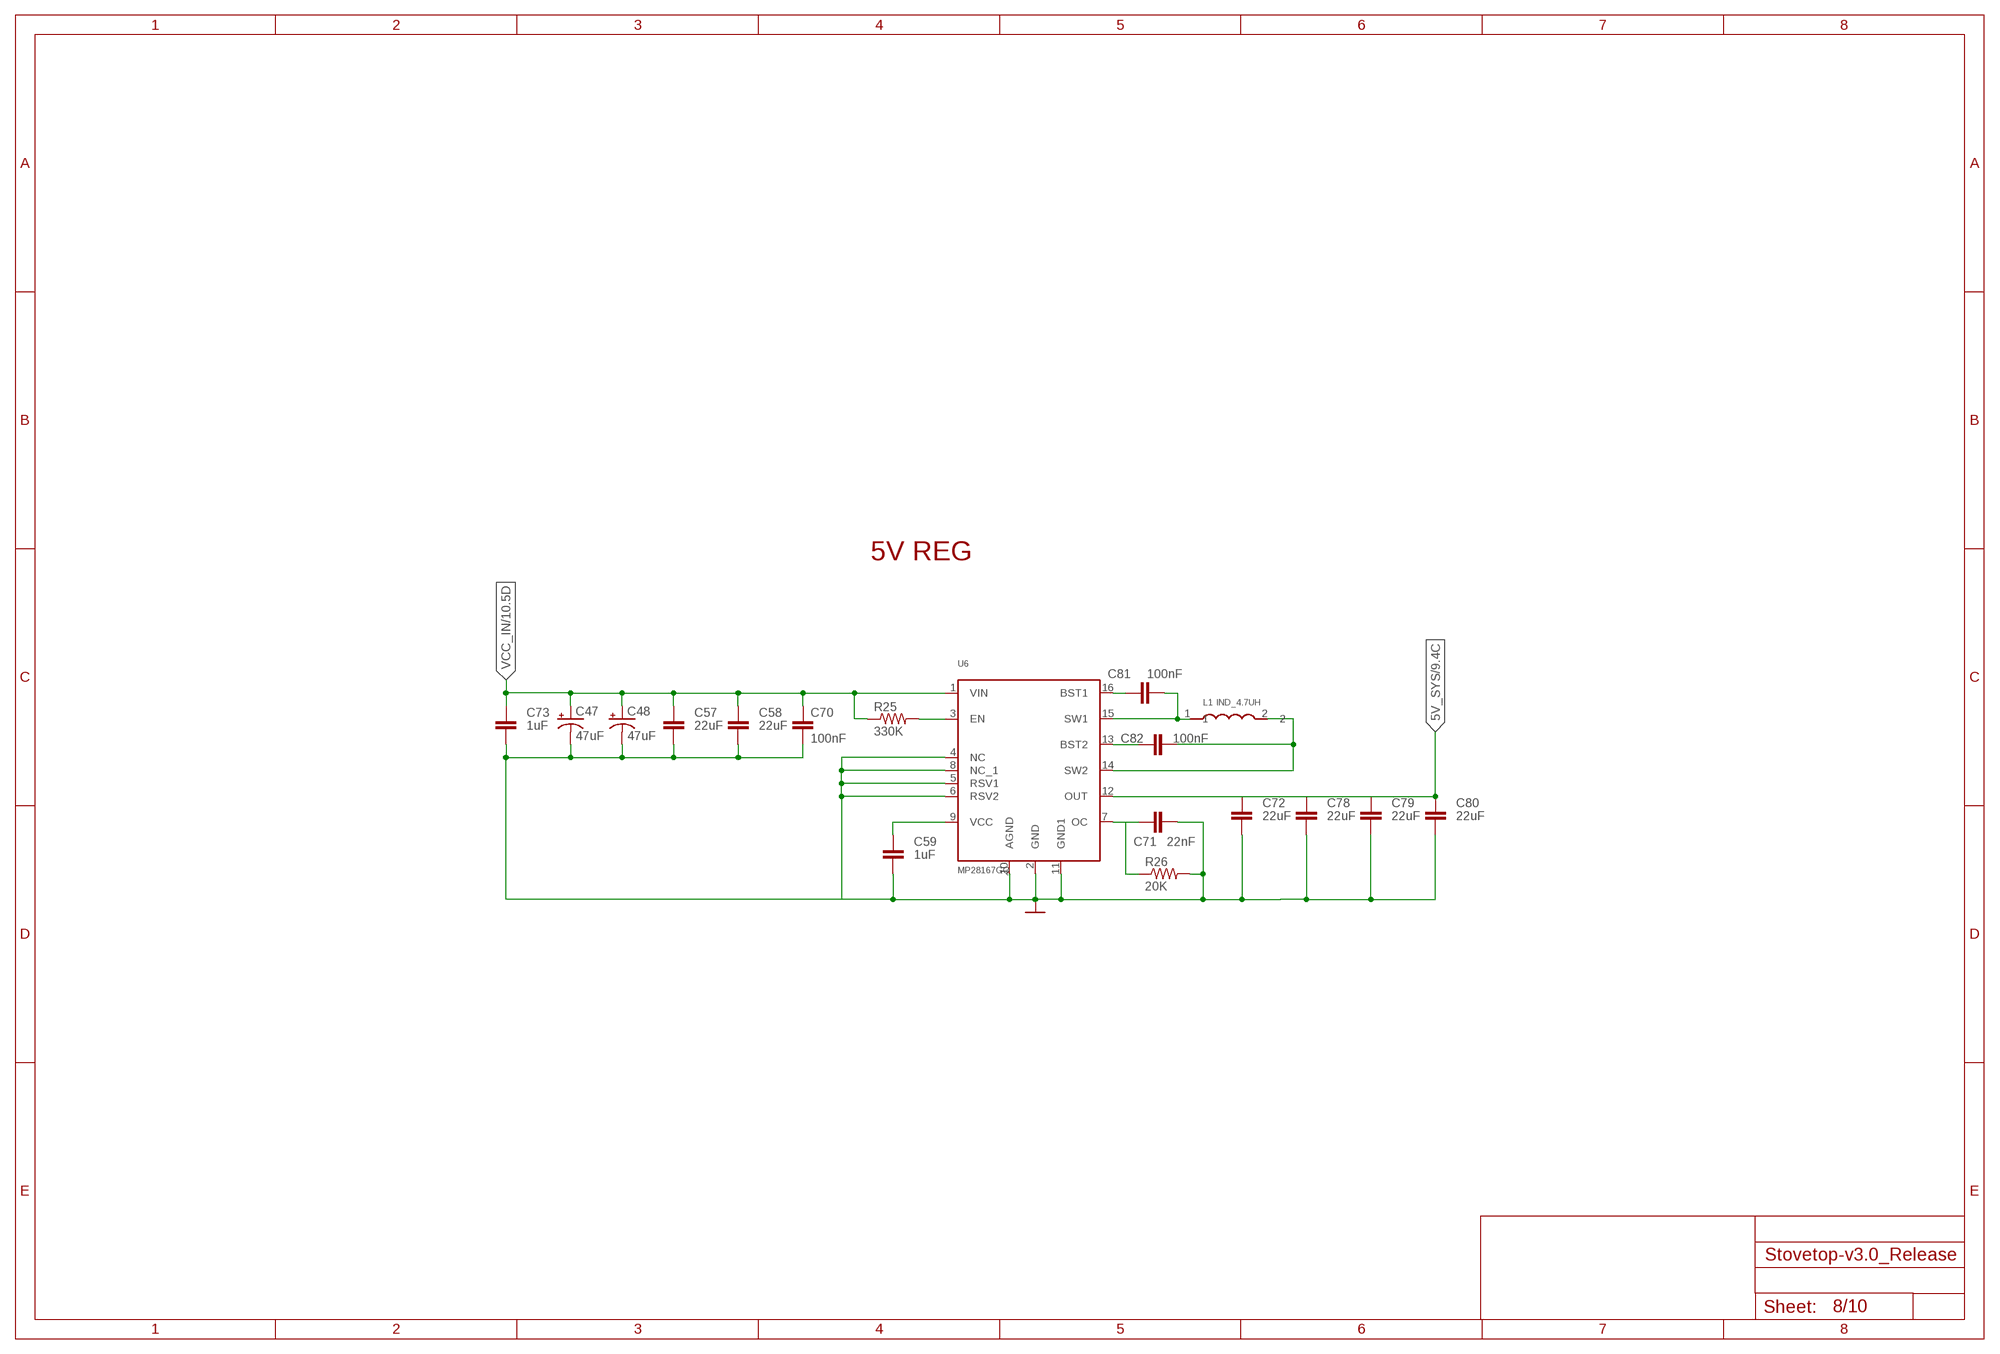
[diagram p7: schematic, sheet 8]

### Parts
C47  47uF  CPOL-USD/7343-31W  [D/7343-31W]
C48  47uF  CPOL-USD/7343-31W  [D/7343-31W]
C57  22uF  CAP0805  [0805]
C58  22uF  CAP0805  [0805]
C59  1uF  CAP0805  [0805]
C70  100nF  C-EUC0402  [C0402]
C71  22nF  CAP0805  [0805]
C72  22uF  CAP0805  [0805]
C73  1uF  CAP0805  [0805]
C78  22uF  CAP0805  [0805]
C79  22uF  CAP0805  [0805]
C80  22uF  CAP0805  [0805]
C81  100nF  C-EUC0402  [C0402]
C82  100nF  C-EUC0402  [C0402]
L1  IND_4.7UH  [IND_4.7UH]
R25  330K  R-US_R0402  [R0402]
R26  20K  R-US_R0603  [R0603]
U6  MP28167GQ  [MP28167GQ]

### Nets
5V_SYS: C72.2 C78.2 C79.2 C80.2 U6.12(OUT) ; also sheet 1,9
GND: C47.- C48.- C57.1 C58.1 C59.1 C70.2 C71.1 C72.1 C73.1 C78.1 C79.1 C80.1 R26.2 U6.2(GND) U6.4(NC) U6.5(RSV1) U6.6(RSV2) U6.8(NC_1) U6.10(AGND) U6.11(GND1) ; also sheet 1,2,3,4,5,6,7,9,10
N$34: C71.2 R26.1 U6.7(OC)
N$53: R25.2 U6.3(EN)
N$57: C59.2 U6.9(VCC)
N$58: C81.1 U6.16(BST1)
N$59: C81.2 L1.1 U6.15(SW1)
N$60: C82.1 U6.13(BST2)
N$61: C82.2 L1.2 U6.14(SW2)
VCC_IN: C47.+ C48.+ C57.2 C58.2 C70.1 C73.2 R25.1 U6.1(VIN) ; also sheet 10

### Notes on the sheet
- 5V REG

## Sheet 9 of 10
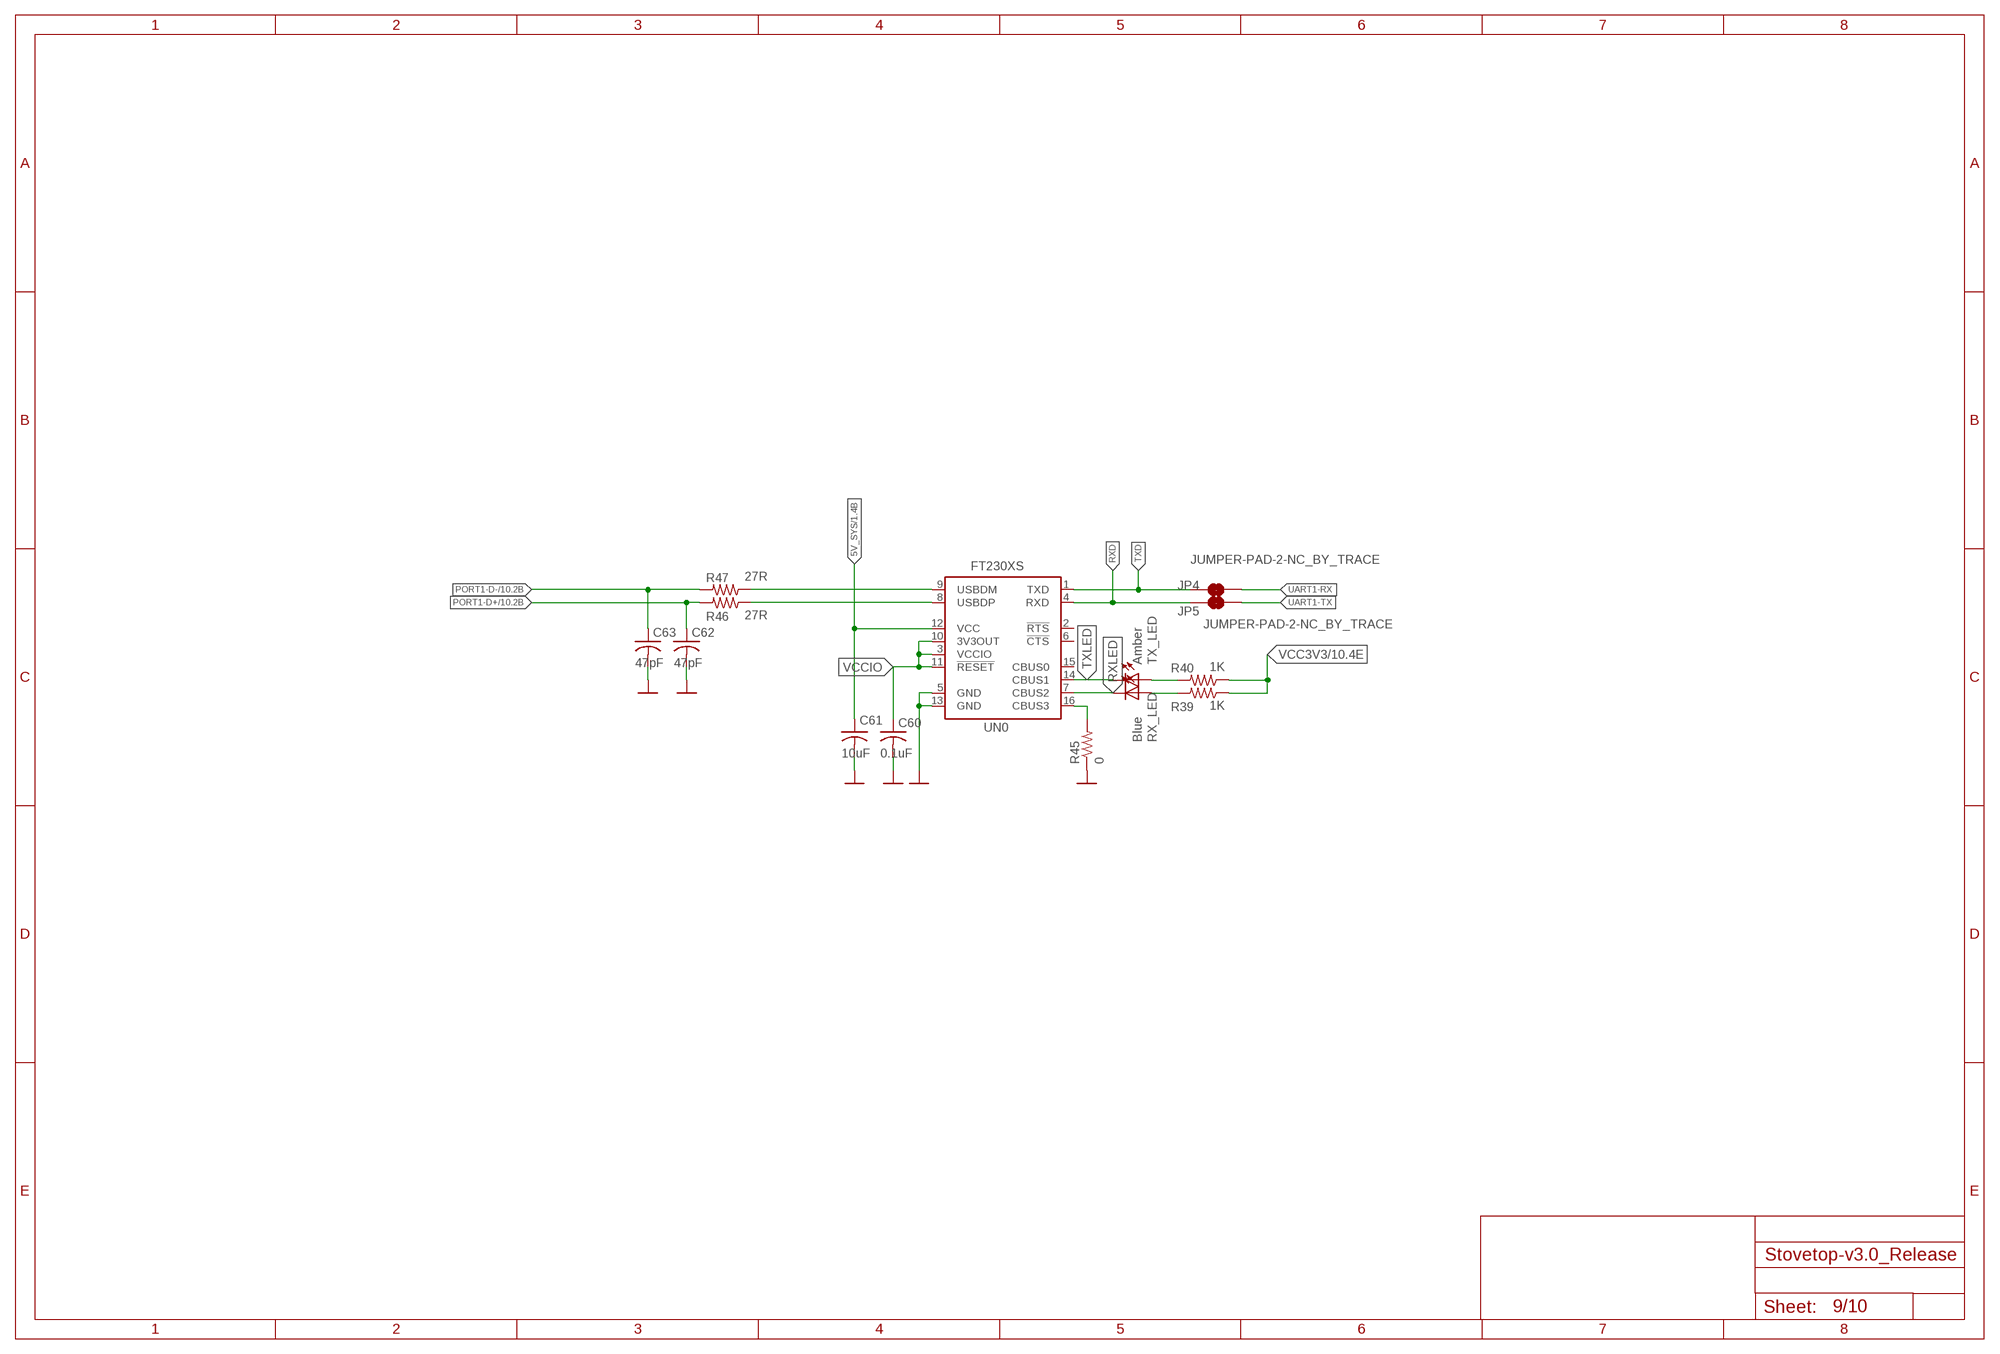
[diagram p8: schematic, sheet 9]

### Parts
C60  0.1uF  C-USC0402  [C0402]
C61  10uF  C-USC0402  [C0402]
C62  47pF  C-USC0402  [C0402]
C63  47pF  C-USC0402  [C0402]
JP4  JUMPER-PAD-2-NC_BY_TRACE  [PAD-JUMPER-2-NC_BY_TRACE_YES_SILK]
JP5  JUMPER-PAD-2-NC_BY_TRACE  [PAD-JUMPER-2-NC_BY_TRACE_YES_SILK]
R39  1K  R-US_R0402  [R0402]
R40  1K  R-US_R0402  [R0402]
R45  0  R-US_R0402  [R0402]
R46  27R  R-US_R0402  [R0402]
R47  27R  R-US_R0402  [R0402]
RX_LED  Blue  LED805  [LED-805]
TX_LED  Amber  LED805  [LED-805]
UN0  FT230XS  [SSOP-16]

### Nets
5V_SYS: C61.1 UN0.12(VCC) ; also sheet 1,8
GND: C60.2 C61.2 C62.2 C63.2 R45.1 UN0.5(GND) UN0.13(GND) ; also sheet 1,2,3,4,5,6,7,8,10
N$43: R47.1 UN0.9(USBDM)
N$55: R46.1 UN0.8(USBDP)
N$63: R45.2 UN0.16(CBUS3)
N$64: R39.2 RX_LED.A
N$65: R40.2 TX_LED.A
PORT1-D+ [diff]: C62.1 R46.2 ; also sheet 7,10
PORT1-D- [diff]: C63.1 R47.2 ; also sheet 7,10
RXD: JP5.1 UN0.4(RXD)
RXLED: RX_LED.C UN0.7(CBUS2)
TXD: JP4.1 UN0.1(TXD)
TXLED: TX_LED.C UN0.14(CBUS1)
UART1-RX: JP4.2 ; also sheet 1
UART1-TX: JP5.2 ; also sheet 1
VCC3V3: R39.1 R40.1 ; also sheet 1,2,3,4,5,10
VCCIO: C60.1 UN0.3(VCCIO) UN0.10(3V3OUT) UN0.11(!RESET)
Unconnected: UN0.2(!RTS) UN0.6(!CTS) UN0.15(CBUS0)

## Sheet 10 of 10
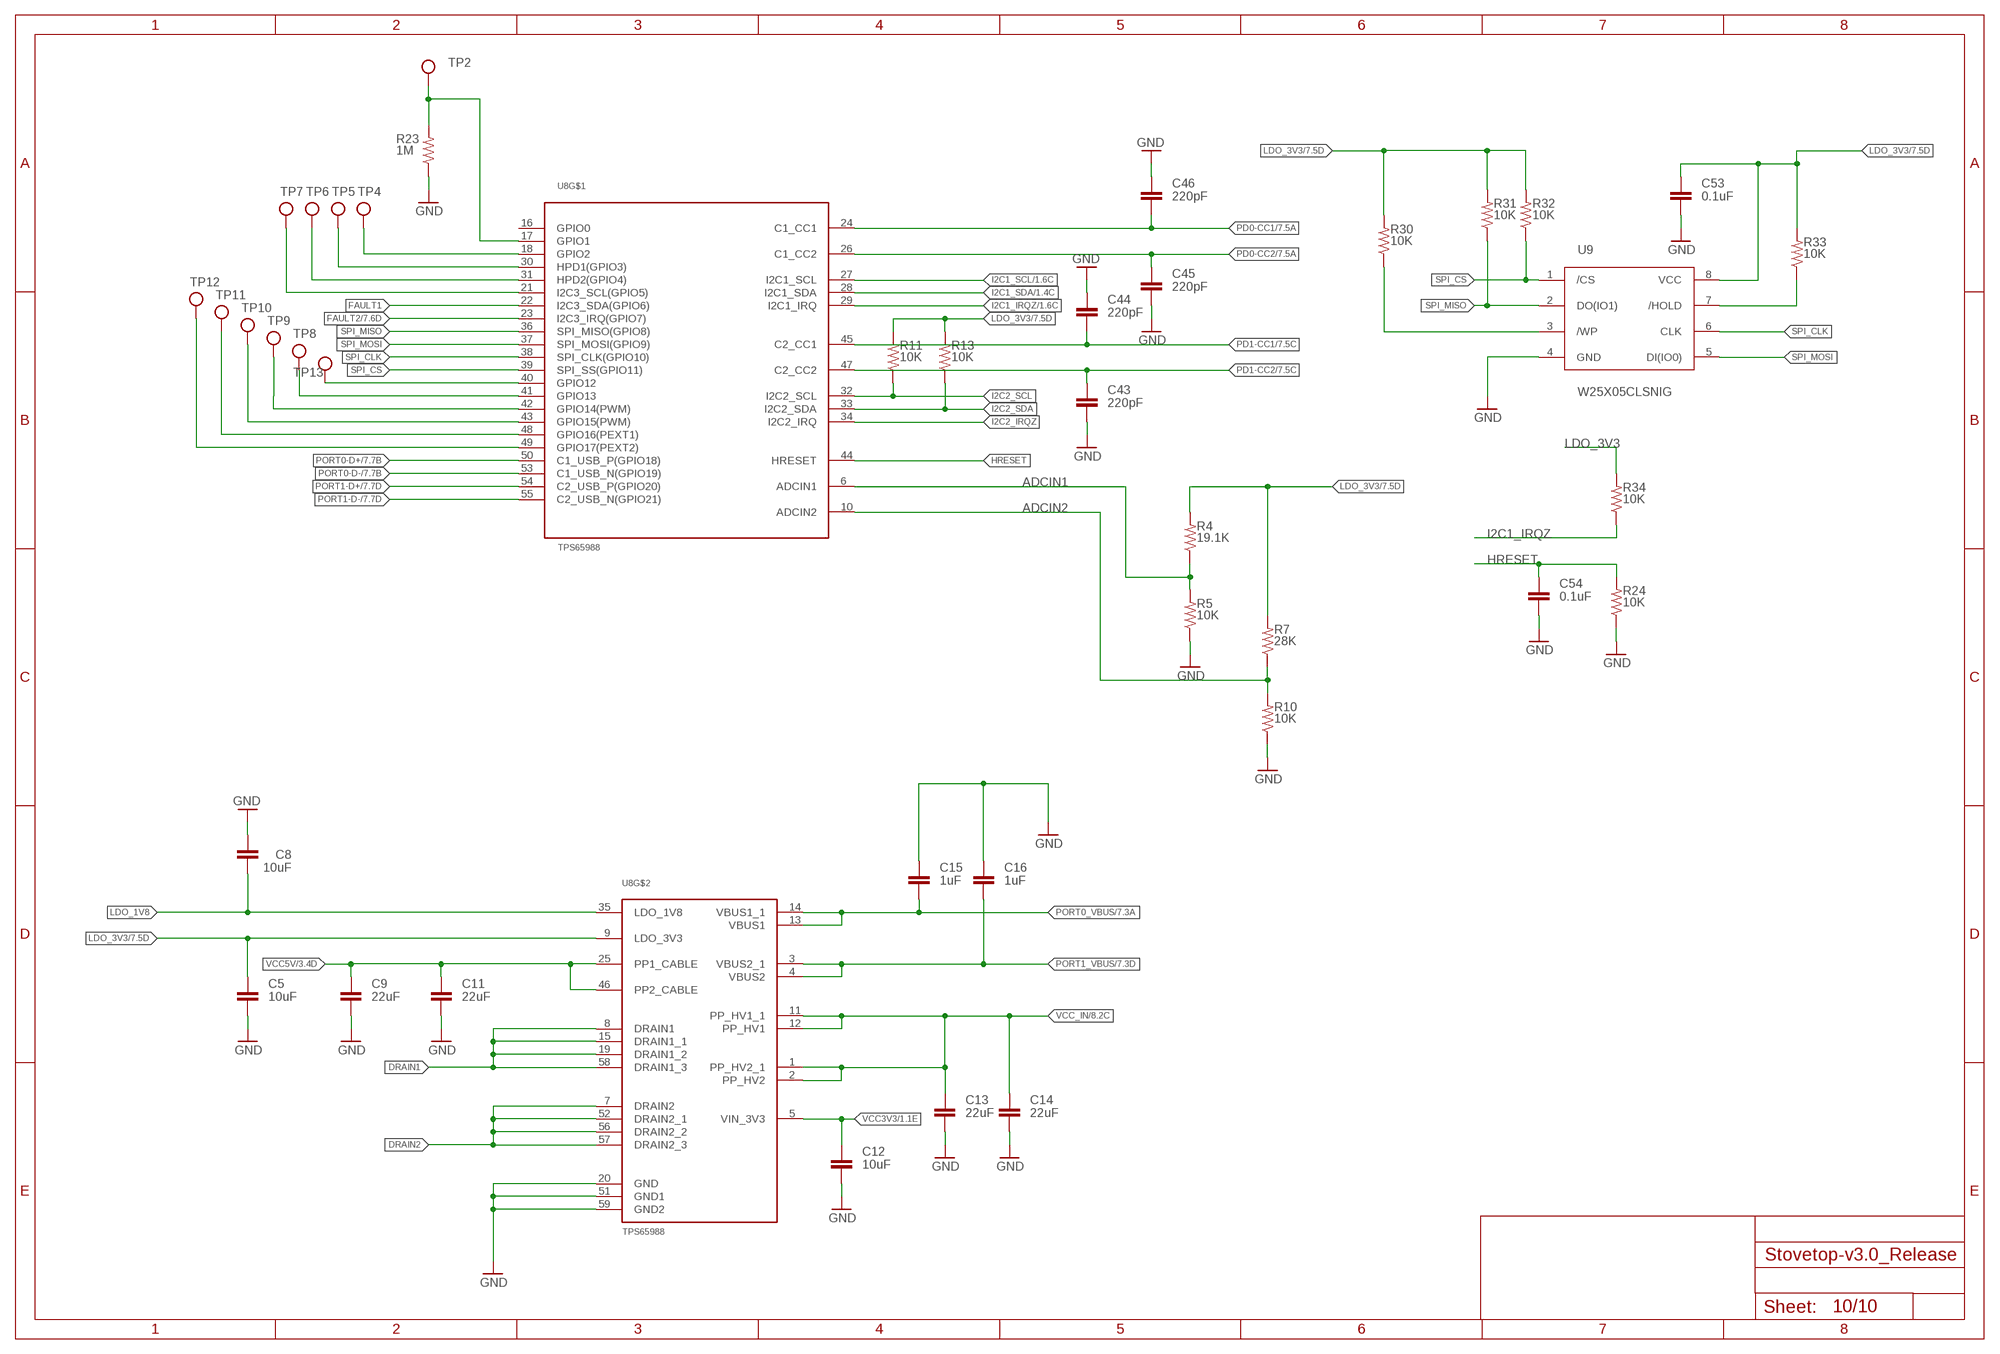
[diagram p9: schematic, sheet 10]

### Parts
C5  10uF  CAP0603-CAP  [0603-CAP]
C8  10uF  CAP0603-CAP  [0603-CAP]
C9  22uF  CAP0805  [0805]
C11  22uF  CAP0805  [0805]
C12  10uF  CAP0603-CAP  [0603-CAP]
C13  22uF  CAP0805  [0805]
C14  22uF  CAP0805  [0805]
C15  1uF  CAP0603-CAP  [0603-CAP]
C16  1uF  CAP0603-CAP  [0603-CAP]
C43  220pF  CAP0603-CAP  [0603-CAP]
C44  220pF  CAP0603-CAP  [0603-CAP]
C45  220pF  CAP0603-CAP  [0603-CAP]
C46  220pF  CAP0603-CAP  [0603-CAP]
C53  0.1uF  CAP0402-CAP  [0402-CAP]
C54  0.1uF  CAP0402-CAP  [0402-CAP]
R4  19.1K  R-US_R0402  [R0402]
R5  10K  R-US_R0402  [R0402]
R7  28K  R-US_R0402  [R0402]
R10  10K  R-US_R0402  [R0402]
R11  10K  R-US_R0402  [R0402]
R13  10K  R-US_R0402  [R0402]
R23  1M  R-US_R0402  [R0402]
R24  10K  R-US_R0402  [R0402]
R30  10K  R-US_R0402  [R0402]
R31  10K  R-US_R0402  [R0402]
R32  10K  R-US_R0402  [R0402]
R33  10K  R-US_R0402  [R0402]
R34  10K  R-US_R0402  [R0402]
TP2  TEST_POINT  [TP-1MMX1MM]
TP4  TEST_POINT  [TP-1MMX1MM]
TP5  TEST_POINT  [TP-1MMX1MM]
TP6  TEST_POINT  [TP-1MMX1MM]
TP7  TEST_POINT  [TP-1MMX1MM]
TP8  TEST_POINT  [TP-1MMX1MM]
TP9  TEST_POINT  [TP-1MMX1MM]
TP10  TEST_POINT  [TP-1MMX1MM]
TP11  TEST_POINT  [TP-1MMX1MM]
TP12  TEST_POINT  [TP-1MMX1MM]
TP13  TEST_POINT  [TP-1MMX1MM]
U8  TPS65988  [TPS65988]
U9  W25X05CLSNIG  [W25X05CLSNIG]

### Nets
ADCIN1: R4.1 R5.2 U8.6(ADCIN1)
ADCIN2: R7.1 R10.2 U8.10(ADCIN2)
ANT_SELECT: TP12.0 U8.49(GPIO17(PEXT2))
AUDIO_EN: TP11.0 U8.48(GPIO16(PEXT1))
DRAIN1: U8.8(DRAIN1) U8.15(DRAIN1_1) U8.19(DRAIN1_2) U8.58(DRAIN1_3)
DRAIN2: U8.7(DRAIN2) U8.52(DRAIN2_1) U8.56(DRAIN2_2) U8.57(DRAIN2_3)
FAULT1: U8.22(I2C3_SDA(GPIO6)) ; also sheet 7
FAULT2: U8.23(I2C3_IRQ(GPIO7)) ; also sheet 7
GND: C5.1 C8.1 C9.1 C11.1 C12.1 C13.1 C14.1 C15.2 C16.2 C43.1 C44.1 C45.1 C46.1 C53.1 C54.1 R5.1 R10.1 R23.1 R24.1 U8.20(GND) U8.51(GND1) U8.59(GND2) U9.4(GND) ; also sheet 1,2,3,4,5,6,7,8,9
HRESET: C54.2 R24.2 U8.44(HRESET) ; also sheet 1
I2C1_IRQZ: R34.1 U8.29(I2C1_IRQ) ; also sheet 1
I2C1_SCL: U8.27(I2C1_SCL) ; also sheet 1
I2C1_SDA: U8.28(I2C1_SDA) ; also sheet 1
I2C2_IRQZ: U8.34(I2C2_IRQ)
I2C2_SCL: R11.1 U8.32(I2C2_SCL)
I2C2_SDA: R13.1 U8.33(I2C2_SDA)
LDO_1V8: C8.2 U8.35(LDO_1V8)
LDO_3V3: C5.2 C53.2 R4.2 R7.2 R11.2 R13.2 R30.2 R31.2 R32.2 R33.2 R34.2 U8.9(LDO_3V3) U9.8(VCC) ; also sheet 7
N$40: R23.2 TP2.0 U8.17(GPIO1)
N$41: R30.1 U9.3(/WP)
N$52: R33.1 U9.7(/HOLD)
PD0-CC1: C46.2 U8.24(C1_CC1) ; also sheet 7
PD0-CC2: C45.2 U8.26(C1_CC2) ; also sheet 7
PD1-CC1: C44.2 U8.45(C2_CC1) ; also sheet 7
PD1-CC2: C43.2 U8.47(C2_CC2) ; also sheet 7
PORT0-D+ [diff]: U8.50(C1_USB_P(GPIO18)) ; also sheet 7
PORT0-D- [diff]: U8.53(C1_USB_N(GPIO19)) ; also sheet 7
PORT0_VBUS: C15.1 U8.13(VBUS1) U8.14(VBUS1_1) ; also sheet 7
PORT1-D+ [diff]: U8.54(C2_USB_P(GPIO20)) ; also sheet 7,9
PORT1-D- [diff]: U8.55(C2_USB_N(GPIO21)) ; also sheet 7,9
PORT1_VBUS: C16.1 U8.3(VBUS2_1) U8.4(VBUS2) ; also sheet 7
SPI_CLK: U8.38(SPI_CLK(GPIO10)) U9.6(CLK)
SPI_CS: R32.1 U8.39(SPI_SS(GPIO11)) U9.1(/CS)
SPI_MISO: R31.1 U8.36(SPI_MISO(GPIO8)) U9.2(DO(IO1))
SPI_MOSI: U8.37(SPI_MOSI(GPIO9)) U9.5(DI(IO0))
USB_SWITCH_OC: TP7.0 U8.21(I2C3_SCL(GPIO5))
VCC3V3: C12.2 U8.5(VIN_3V3) ; also sheet 1,2,3,4,5,9
VCC5V: C9.2 C11.2 U8.25(PP1_CABLE) U8.46(PP2_CABLE) ; also sheet 1,3,4
VCC_IN: C13.2 C14.2 U8.1(PP_HV2_1) U8.2(PP_HV2) U8.11(PP_HV1_1) U8.12(PP_HV1) ; also sheet 8
XIO-P1: TP4.0 U8.18(GPIO2)
XIO-P2: TP5.0 U8.30(HPD1(GPIO3))
XIO-P3: TP6.0 U8.31(HPD2(GPIO4))
XIO-P4: TP13.0 U8.40(GPIO12)
XIO-P5: TP8.0 U8.41(GPIO13)
XIO-P6: TP9.0 U8.42(GPIO14(PWM))
XIO-P7: TP10.0 U8.43(GPIO15(PWM))
Unconnected: U8.16(GPIO0)

## Library data of the parts
C1-C5 C8 C9 C11-C16 C43-C46 C50 C52-C55 C57-C59 C64-C67 C69 C71-C80 = SparkFun:CAP: Capacitor Standard 0603 ceramic capacitor, and 0.1" leaded capacitor.
C6 C17-C42 = CHIP_HDMI:CAPACITOR
C7 = Keyboard v0_5:C1206_22UF_50V_10%; DESCRIPTION: CAP ceramic smd 20% 35V 1206; FOOTPRINT: C1206; LINK: http://www.digikey.com/product-detail/en/C3216X5R1V226M160AC/445-8045-1-ND/2792165; MFG: DIGIKEY; MFG_PN: 445-8045-1-ND; PART_TYPE: C1206; PRICE: 0.01; TOLLERANCE: 20%; VENDOR: TDK; VENDOR_PART_NUMBER: C3216X5R1V226M160AC
C10 = Keyboard v0_5:C0402_100NF_50V_10%; DESCRIPTION: CAP CER SMD 100nF 25V 10% 0402; FOOTPRINT: C0402; LINK: http://www.digikey.co.il/product-detail/en/C1005X5R1E104K050BC/445-4964-1-ND/2093578; MFG: DIGIIKEY; MFG_PN: 445-4964-1-ND; PART_TYPE: C0402; PRICE: 0.01; TOLLERANCE: 10%; VENDOR: TDK; VENDOR_PART_NUMBER: C1005X5R1E104K050BC
C47 C48 = resistor:CPOL-US: POLARIZED CAPACITOR, American symbol
C49 C51 = SparkFun-Capacitors:4.7UF: 4.7µF ceramic capacitors A capacitor is a passive two-terminal electrical component used to store electrical energy temporarily in an electric field.; PROD_ID: CAP-08280; VALUE: 4.7uF
C56 C68 = SparkFun:CAP_POL: Capacitor Polarized These are standard SMD and PTH capacitors. Normally 10uF, 47uF, and 100uF in electrolytic and tantalum varieties. Always verify the external diameter of the through hole cap, it varies with capacity, voltage, and manufacturer. The EIA devices should be standard.
C60-C63 = CHIP_PRO_Dev-Kit-v0.1:C-US: CAPACITOR, American symbol
C70 C81 C82 = resistor:C-EU: CAPACITOR, European symbol
C83-C87 C89-C93 = rcl:C-EU: CAPACITOR, European symbol
C88 = rcl:CPOL-EU: POLARIZED CAPACITOR, European symbol
D1-D3 = CHIP_HDMI:D-SEMTECH-RCLAMP0504S
D4 = CHIP_HDMI:B240A
J1 = Stovetop-v2.0_21082020_1120:POCKETCHIP-V1.0_98401-801-40LF
J2 = CONNECTER:HR911105A
J3 = Stovetop-v2.0_21082020_1120:STOVETOP-V2.0_03062020_1600_STOVETOP-V2.0_CHECK_TRISTAN-ROBITAILLE'S-LIBRARY_DX07S024JJ2_USB_TYPE-C: JAE DX07S024JJ2 USB Type-C Connector ***Footprint contains plated drill holes (2mm diameter) instead of plated slots (easier on fabhouse)*** Technical Specifications: Mating cycles: 10,000 times Contact resistance: 40mΩ (max.) Rated current: 1.25A (max.) on pins A1, A4, A9, A12, B1, B4, B5, B9 and B12 0.25A (max.) on others Rated voltage: 20Vrms Datasheet <https://www.jae.com/z-en/pdf_download_exec.cfm?param=MB-0297-3E_DX07.pdf> Digi-Key part #: 670-2794-6-ND <http://www.digikey.com/product-detail/en/jae-electronics/DX07S024JJ2R1300/670-2794-6-ND/5246069> Mouser part #: 656-DX07S024JJ2R1300 <http://ca.mouser.com/ProductDetail/JAE-Electronics/DX07S024JJ2R1300/?qs=%2fha2pyFaduhsAyGD7ZqdDeHjVi4g0c8wrw%252bV08Os%252brQ5DqW1EY3Lew%3d%3d> Manufacturer part #: DX07S024JJ2R1300; REFDES: J3
J4 = Stovetop-v2.0_21082020_1120:STOVETOP-V2.0_03062020_1600_STOVETOP-V2.0_CHECK_TRISTAN-ROBITAILLE'S-LIBRARY_DX07S024JJ2_USB_TYPE-C: JAE DX07S024JJ2 USB Type-C Connector ***Footprint contains plated drill holes (2mm diameter) instead of plated slots (easier on fabhouse)*** Technical Specifications: Mating cycles: 10,000 times Contact resistance: 40mΩ (max.) Rated current: 1.25A (max.) on pins A1, A4, A9, A12, B1, B4, B5, B9 and B12 0.25A (max.) on others Rated voltage: 20Vrms Datasheet <https://www.jae.com/z-en/pdf_download_exec.cfm?param=MB-0297-3E_DX07.pdf> Digi-Key part #: 670-2794-6-ND <http://www.digikey.com/product-detail/en/jae-electronics/DX07S024JJ2R1300/670-2794-6-ND/5246069> Mouser part #: 656-DX07S024JJ2R1300 <http://ca.mouser.com/ProductDetail/JAE-Electronics/DX07S024JJ2R1300/?qs=%2fha2pyFaduhsAyGD7ZqdDeHjVi4g0c8wrw%252bV08Os%252brQ5DqW1EY3Lew%3d%3d> Manufacturer part #: DX07S024JJ2R1300; REFDES: J4
J5 J6 = Stovetop:CONN_02: Multi connection point. Often used as Generic Header-pin footprint for 0.1 inch spaced/style header connections On any of the 0.1 inch spaced packages, you can populate with these: Break Away Headers - Straight <https://www.sparkfun.com/products/116> (PRT-00116) Break Away Male Headers - Right Angle <https://www.sparkfun.com/products/553> (PRT-00553) Female Headers <https://www.sparkfun.com/products/115> (PRT-00115) Break Away Headers - Machine Pin <https://www.sparkfun.com/products/117> (PRT-00117) Break Away Female Headers - Swiss Machine Pin <https://www.sparkfun.com/products/743> (PRT-00743) For SCREWTERMINALS and SPRING TERMINALS visit here: Screw Terimnals on SparkFun.com <https://www.sparkfun.com/search/results?term=Screw+Terminals> (5mm/3.5mm/2.54mm spacing) This device is also useful as a general connection point to wire up your design to another part of your project. Our various solder wires solder well into these plated through hole pads. Hook-Up Wire - Assortment (Stranded, 22 AWG) <https://www.sparkfun.com/products/11375> (PRT-11375) Hook-Up Wire - Assortment (Solid Core, 22 AWG) <https://www.sparkfun.com/products/11367> (PRT-11367) View the entire wire category on our website here <https://www.sparkfun.com/categories/141> Special notes: Molex polarized connector foot print use with: PRT-08233 with associated crimp pins and housings. 2.54_SCREWTERM for use with PRT-10571. 3.5mm Screw Terminal footprints for PRT-08084 5mm Screw Terminal footprints for use with PRT-08432
J8 = Stovetop-v2.0_21082020_1120:CHIP_HDMI_T_MOLEX_45171
JP1 JP2 = SparkFun-Jumpers:JUMPER-SMT_3_1-NC_PASTE: Normally closed solder jumper (1 of 2 connections) This jumper has an aperture in the stencil to allow solder paste to bridge one of the two connections. One connection is normally closed (NC), while the other is normally open (NO). Wick off the solder to open the connection. Reapply solder to reclose the connection. Apply solder to the other side instead to change the current path.
JP4 JP5 = CHIP_PRO_Dev-Kit-v0.1:JUMPER-PAD-2-NC_BY_TRACE
L1 = IND_4.7uH:IND_4.7UH
L2-L6 = CHIP_HDMI:ACML
L7 = wuerth-elektronik:WE-KIL: SMD Wire Wound Ceramic Inductor WE-KIL - Low profile - High Q values -- Bluetooth -- Wireless LAN -- RF oscillation circuit -- IF impedance matching
Q5 = RemoteSix-v0.1:CRISTALLI_0846_FTX25.000M12SM3S: 25Mhz - K7 12pF - SMD; MONTHLY_USAGE: _____; PART_NUMBER: FTX25.000M12SM3S; PRICE: _____; SUPPLIER: _____; TYPE: Cristalli
R1-R3 R6 R27 R35 R37 R41 R42 R44 = rcl:R-EU_: RESISTOR, European symbol
R4 R5 R7 R10 R11 R13 R23 R24 R28-R34 = rcl:R-US_: RESISTOR, American symbol; SPICEPREFIX: R
R8 R9 R14-R22 R36 R38 R48-R52 = CHIP_HDMI:RESISTOR
R12 = Keyboard v0_5:R0402_4K7_5%; DESCRIPTION: RES SMD 4.7K Ohm 1/16W 5% oHS 0402; FOOTPRINT: R0402; LINK: http://search.digikey.com/us/en/products/ERJ-2GEJ472X/P4.7KJCT-ND/147025; MFG: DIGIKEY; MFG_PN: P4.7KJCT-ND; PART_TYPE: R0402; PRICE: 0.01; TOLLERANCE: 5%; VENDOR: PANASONIC; VENDOR_PART_NUMBER: ERJ-2GEJ472X
R25 R26 = resistor:R-US_: RESISTOR, American symbol
R39 R40 R46 R47 = GR8_Module-Eval-v0.1:R-US_: RESISTOR, American symbol
R45 = CHIP_PRO_Dev-Kit-v0.1:R-US_: RESISTOR, American symbol
RX_LED TX_LED = dp_devices:LED
S1 S2 = Stovetop-v2.0:1TS009A
SJ3 = Stovetop-v2.0_21082020_1120:SPARKFUN_SOLDERJUMPER: Solder Jumper Standard SMD solder jumper. Used to automate production. Two varients : Normally Open and Normally Closed are the same, but have different paste layers. NC will have a large amount of paste and should jumper during reflow.
TP1 = Stovetop-v2.0_21082020_1120:CHIP_HDMI_TEST_POINT
TP2 TP4-TP13 = CHIP_HDMI:TEST_POINT
TVS1 TVS2 = Stovetop:TVS2200
U1 U2 = Stovetop:TPD6S300
U3 = Keyboard v0_5:DS2431: 1024-Bit EEPROM This chip provides a 4x256 Bit EEPROM, which can be programmed@5V. Write protection and OTP emulation are available, too. Author: Jan Kandziora <jjj@gmx.de>; DESCRIPTION: IC, 1024-Bit, 1-Wire EEPROM, TSOC6; FOOTPRINT: TSOC6; LINK: http://www.digikey.com/product-detail/en/DS2431P%2BT%26R/DS2431P%2BT%26RCT-ND/3647900; MFG: DIGIKEY; MFG_PN: DS2431P+T&RCT-ND; PART_TYPE: IC; PRICE: 0.98; VENDOR: MAXIM; VENDOR_PART_NUMBER: DS2431P+T&R
U4 = CHIP_HDMI:CH7053A
U5 = CHIP_HDMI:LP5907MFX
U6 = MP28167GQ:MP28167GQ
U7 = SparkFun:PCM1803: 24-bit ADC
U8 = Stovetop:TPS65988
U9 = Stovetop:W25X05CLSNIG
U10 = dp_devices:ENC424J600: Stand-Alone 10/100 Ethernet Controller with SPI or Parallel Interface Source: http://ww1.microchip.com/downloads/en/DeviceDoc/39935c.pdf
UN0 = ftdichip:FT230X
Y1 = CHIP_HDMI:ABM3B
Y2 = SparkFun:OSCILLATOR

## Net classes
2 diff: width 0.14 mm
3 SPI DIFF: width 0.241 mm, clearance 0.152 mm